# Altium project MU-RK3576J-MB.PrjPCB (part 7 of 13)

## Sheet V-by-One.SchDoc
size 420 x 297 mm; SheetNumber: 21; SheetTotal: 32; DocumentTypeShort: Э3; DocumentInvertoryNumber: ㅤ
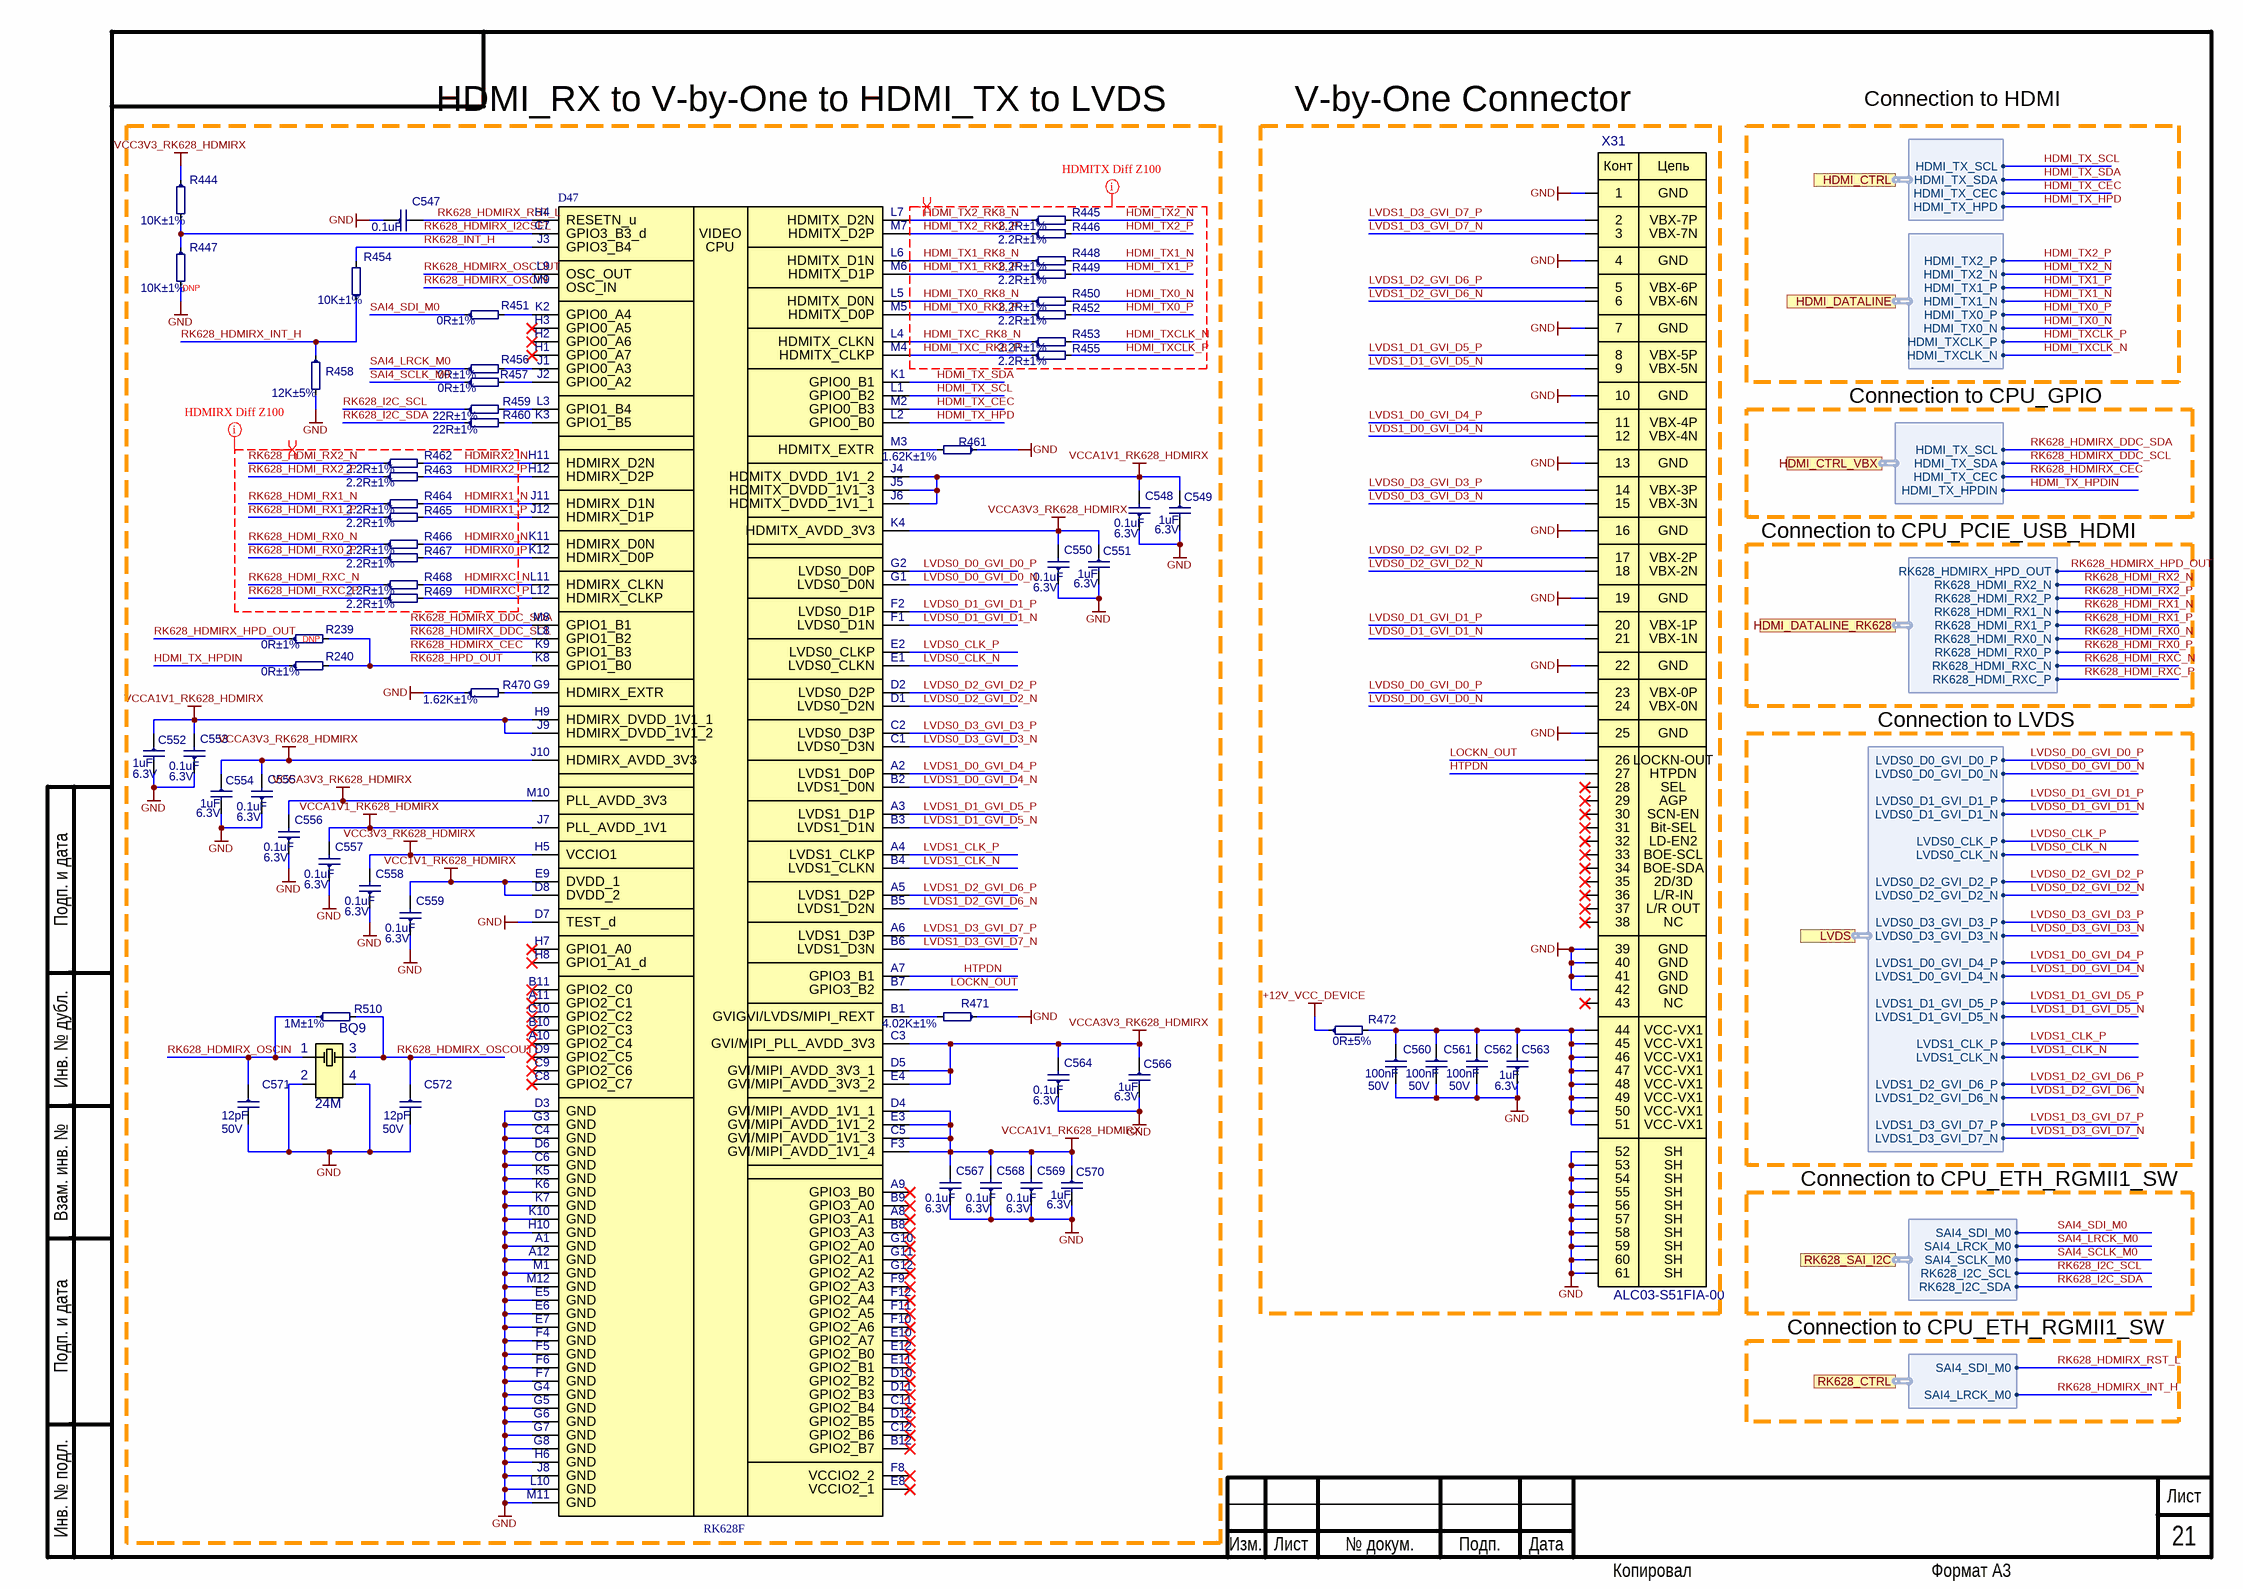
[diagram p17: V-by-One.SchDoc]

### Parts
BQ9  24M  [NX3225GA]
C547  0.1uF  [C0201]
C548  0.1uF  Voltage: 6.3V  [C0201]
C549  1uF  Voltage: 6.3V  [C0201]
C550  0.1uF  Voltage: 6.3V  [C0201]
C551  1uF  Voltage: 6.3V  [C0201]
C552  1uF  Voltage: 6.3V  [C0201]
C553  0.1uF  Voltage: 6.3V  [C0201]
C554  1uF  Voltage: 6.3V  [C0201]
C555  0.1uF  Voltage: 6.3V  [C0201]
C556  0.1uF  Voltage: 6.3V  [C0201]
C557  0.1uF  Voltage: 6.3V  [C0201]
C558  0.1uF  Voltage: 6.3V  [C0201]
C559  0.1uF  Voltage: 6.3V  [C0201]
C560  100nF  Voltage: 50V  [C0402]
C561  100nF  Voltage: 50V  [C0402]
C562  100nF  Voltage: 50V  [C0402]
C563  1uF  Voltage: 6.3V  [C0201]
C564  0.1uF  Voltage: 6.3V  [C0201]
C566  1uF  Voltage: 6.3V  [C0201]
C567  0.1uF  Voltage: 6.3V  [C0201]
C568  0.1uF  Voltage: 6.3V  [C0201]
C569  0.1uF  Voltage: 6.3V  [C0201]
C570  1uF  Voltage: 6.3V  [C0201]
C571  12pF  Voltage: 50V  [C0402]
C572  12pF  Voltage: 50V  [C0402]
D47  RK628F  [RK628F]
R239  0R±1%  [R0402]
R240  0R±1%  [R0402]
R444  10K±1%  [R0402]
R445  2.2R±1%  [R0402]
R446  2.2R±1%  [R0402]
R447  10K±1%  [R0402]
R448  2.2R±1%  [R0402]
R449  2.2R±1%  [R0402]
R450  2.2R±1%  [R0402]
R451  0R±1%  [R0402]
R452  2.2R±1%  [R0402]
R453  2.2R±1%  [R0402]
R454  10K±1%  [R0402]
R455  2.2R±1%  [R0402]
R456  0R±1%  [R0402]
R457  0R±1%  [R0402]
R458  12K±5%  [R0402]
R459  22R±1%  [R0402]
R460  22R±1%  [R0402]
R461  1.62K±1%  [R0402]
R462  2.2R±1%  [R0402]
R463  2.2R±1%  [R0402]
R464  2.2R±1%  [R0402]
R465  2.2R±1%  [R0402]
R466  2.2R±1%  [R0402]
R467  2.2R±1%  [R0402]
R468  2.2R±1%  [R0402]
R469  2.2R±1%  [R0402]
R470  1.62K±1%  [R0402]
R471  4.02K±1%  [R0402]
R472  0R±5%  [R2010]
R510  1M±1%  [R0402]
X31  ALC03-S51FIA-00  [ALC03-S51FIA-00]

### Ports
HDMI_CTRL (harness HDMI_CTRL), HDMI_CTRL_VBX (harness HDMI_CTRL_VBX), HDMI_DATALINE (harness HDMI_DATALINE), HDMI_DATALINE_RK628 (harness HDMI_DATALINE_RK628), LVDS (harness LVDS), RK628_CTRL (harness RK628_CTRL), RK628_SAI_I2C (harness RK628_SAI_I2C)

### Harnesses
HDMI_CTRL: HDMI_TX_SDA, HDMI_TX_CEC, HDMI_TX_HPD, HDMI_TX_SCL
HDMI_DATALINE: HDMI_TX2_N, HDMI_TX1_P, HDMI_TX1_N, HDMI_TX2_P, HDMI_TX0_P, HDMI_TX0_N, HDMI_TXCLK_P, HDMI_TXCLK_N
HDMI_CTRL_VBX: HDMI_TX_SDA, HDMI_TX_CEC, HDMI_TX_SCL, HDMI_TX_HPDIN
LVDS: LVDS0_D0_GVI_D0_N, LVDS0_D1_GVI_D1_P, LVDS0_D1_GVI_D1_N, LVDS0_D0_GVI_D0_P, LVDS0_CLK_P, LVDS0_CLK_N, LVDS0_D2_GVI_D2_P, LVDS0_D2_GVI_D2_N, LVDS0_D3_GVI_D3_P, LVDS0_D3_GVI_D3_N, LVDS1_D0_GVI_D4_P, LVDS1_D0_GVI_D4_N, LVDS1_D1_GVI_D5_P, LVDS1_D1_GVI_D5_N, LVDS1_CLK_P, LVDS1_CLK_N, LVDS1_D2_GVI_D6_P, LVDS1_D2_GVI_D6_N, LVDS1_D3_GVI_D7_P, LVDS1_D3_GVI_D7_N
HDMI_DATALINE_RK628: RK628_HDMI_RX2_P, RK628_HDMI_RX1_N, RK628_HDMI_RX1_P, RK628_HDMI_RX2_N, RK628_HDMI_RX0_N, RK628_HDMI_RX0_P, RK628_HDMI_RXC_N, RK628_HDMI_RXC_P, RK628_HDMIRX_HPD_OUT
RK628_SAI_I2C: SAI4_LRCK_M0, SAI4_SCLK_M0, SAI4_SDI_M0, RK628_I2C_SCL, RK628_I2C_SDA
RK628_CTRL: SAI4_LRCK_M0, SAI4_SDI_M0

### Nets
+12V_VCC_DEVICE: R472.1
GND: BQ9.2 BQ9.4 C547.1 C548.1 C549.2 C550.1 C551.2 C552.2 C553.1 C554.2 C555.1 C556.1 C557.1 C558.1 C559.1 C560.2 C561.2 C562.2 C563.1 C564.1 C566.2 C567.1 C568.1 C569.1 C570.2 C571.2 C572.2 D47.A1(GND) D47.A12(GND) D47.C4(GND) D47.C6(GND) D47.D3(GND) D47.D6(GND) D47.D7(TEST_d) D47.E5(GND) D47.E6(GND) D47.E7(GND) D47.F4(GND) D47.F5(GND) D47.F6(GND) D47.F7(GND) D47.G3(GND) D47.G4(GND) D47.G5(GND) D47.G6(GND) D47.G7(GND) D47.G8(GND) D47.H6(GND) D47.H10(GND) D47.J8(GND) D47.K5(GND) D47.K6(GND) D47.K7(GND) D47.K10(GND) D47.L10(GND) D47.M1(GND) D47.M11(GND) D47.M12(GND) R447.2 R458.2 R461.1 R470.1 R471.1 X31.1 X31.4 X31.7 X31.10 X31.13 X31.16 X31.19 X31.22 X31.25 X31.39 X31.40 X31.41 X31.42 X31.52 X31.53 X31.54 X31.55 X31.56 X31.57 X31.58 X31.59 X31.60 X31.61
VCC1V1_RK628_HDMIRX: C559.2 D47.D8(DVDD_2) D47.E9(DVDD_1)
VCC3V3_RK628_HDMIRX: C558.2 D47.H5(VCCIO1) R444.1
VCCA1V1_RK628_HDMIRX: C548.2 C549.1 C552.1 C553.2 C557.2 C567.2 C568.2 C569.2 C570.1 D47.C5(GVI/MIPI_AVDD_1V1_3) D47.D4(GVI/MIPI_AVDD_1V1_1) D47.E3(GVI/MIPI_AVDD_1V1_2) D47.F3(GVI/MIPI_AVDD_1V1_4) D47.H9(HDMIRX_DVDD_1V1_1) D47.J4(HDMITX_DVDD_1V1_2) D47.J5(HDMITX_DVDD_1V1_3) D47.J6(HDMITX_DVDD_1V1_1) D47.J7(PLL_AVDD_1V1) D47.J9(HDMIRX_DVDD_1V1_2)
VCCA3V3_RK628_HDMIRX: C550.2 C551.1 C554.1 C555.2 C556.2 C564.2 C566.1 D47.C3(GVI/MIPI_PLL_AVDD_3V3) D47.D5(GVI/MIPI_AVDD_3V3_1) D47.E4(GVI/MIPI_AVDD_3V3_2) D47.J10(HDMIRX_AVDD_3V3) D47.K4(HDMITX_AVDD_3V3) D47.M10(PLL_AVDD_3V3)
HDMI_TX0_N: R450.2 ; port HDMI_DATALINE.HDMI_TX0_N
HDMI_TX0_P: R452.2 ; port HDMI_DATALINE.HDMI_TX0_P
HDMI_TX0_RK8_N: D47.L5(HDMITX_D0N) R450.1
HDMI_TX0_RK8_P: D47.M5(HDMITX_D0P) R452.1
HDMI_TX1_N: R448.2 ; port HDMI_DATALINE.HDMI_TX1_N
HDMI_TX1_P: R449.2 ; port HDMI_DATALINE.HDMI_TX1_P
HDMI_TX1_RK8_N: D47.L6(HDMITX_D1N) R448.1
HDMI_TX1_RK8_P: D47.M6(HDMITX_D1P) R449.1
HDMI_TX2_N: R445.2 ; port HDMI_DATALINE.HDMI_TX2_N
HDMI_TX2_P: R446.2 ; port HDMI_DATALINE.HDMI_TX2_P
HDMI_TX2_RK8_N: D47.L7(HDMITX_D2N) R445.1
HDMI_TX2_RK8_P: D47.M7(HDMITX_D2P) R446.1
HDMI_TX_CEC: D47.M2(GPIO0_B3) ; port HDMI_CTRL.HDMI_TX_CEC
HDMI_TX_HPD: D47.L2(GPIO0_B0) ; port HDMI_CTRL.HDMI_TX_HPD
HDMI_TX_HPDIN: R240.1 ; port HDMI_CTRL_VBX.HDMI_TX_HPDIN  [project net HDMI_CTRL_VBX.HDMI_TX_HPDIN]
HDMI_TX_SCL: D47.L1(GPIO0_B2) ; port HDMI_CTRL.HDMI_TX_SCL
HDMI_TX_SDA: D47.K1(GPIO0_B1) ; port HDMI_CTRL.HDMI_TX_SDA
HDMI_TXC_RK8_N: D47.L4(HDMITX_CLKN) R453.1
HDMI_TXC_RK8_P: D47.M4(HDMITX_CLKP) R455.1
HDMI_TXCLK_N: R453.2 ; port HDMI_DATALINE.HDMI_TXCLK_N
HDMI_TXCLK_P: R455.2 ; port HDMI_DATALINE.HDMI_TXCLK_P
HDMIRX0_N: D47.K11(HDMIRX_D0N) R466.2
HDMIRX0_P: D47.K12(HDMIRX_D0P) R467.2
HDMIRX1_N: D47.J11(HDMIRX_D1N) R464.2
HDMIRX1_P: D47.J12(HDMIRX_D1P) R465.2
HDMIRX2_N: D47.H11(HDMIRX_D2N) R462.2
HDMIRX2_P: D47.H12(HDMIRX_D2P) R463.2
HDMIRXC_N: D47.L11(HDMIRX_CLKN) R468.2
HDMIRXC_P: D47.L12(HDMIRX_CLKP) R469.2
HTPDN: D47.A7(GPIO3_B1) X31.27
LOCKN_OUT: D47.B7(GPIO3_B2) X31.26
LVDS0_CLK_N: D47.E1(LVDS0_CLKN) ; port LVDS.LVDS0_CLK_N
LVDS0_CLK_P: D47.E2(LVDS0_CLKP) ; port LVDS.LVDS0_CLK_P
LVDS0_D0_GVI_D0_N: D47.G1(LVDS0_D0N) X31.24 ; port LVDS.LVDS0_D0_GVI_D0_N
LVDS0_D0_GVI_D0_P: D47.G2(LVDS0_D0P) X31.23 ; port LVDS.LVDS0_D0_GVI_D0_P
LVDS0_D1_GVI_D1_N: D47.F1(LVDS0_D1N) X31.21 ; port LVDS.LVDS0_D1_GVI_D1_N
LVDS0_D1_GVI_D1_P: D47.F2(LVDS0_D1P) X31.20 ; port LVDS.LVDS0_D1_GVI_D1_P
LVDS0_D2_GVI_D2_N: D47.D1(LVDS0_D2N) X31.18 ; port LVDS.LVDS0_D2_GVI_D2_N
LVDS0_D2_GVI_D2_P: D47.D2(LVDS0_D2P) X31.17 ; port LVDS.LVDS0_D2_GVI_D2_P
LVDS0_D3_GVI_D3_N: D47.C1(LVDS0_D3N) X31.15 ; port LVDS.LVDS0_D3_GVI_D3_N
LVDS0_D3_GVI_D3_P: D47.C2(LVDS0_D3P) X31.14 ; port LVDS.LVDS0_D3_GVI_D3_P
LVDS1_CLK_N: D47.B4(LVDS1_CLKN) ; port LVDS.LVDS1_CLK_N
LVDS1_CLK_P: D47.A4(LVDS1_CLKP) ; port LVDS.LVDS1_CLK_P
LVDS1_D0_GVI_D4_N: D47.B2(LVDS1_D0N) X31.12 ; port LVDS.LVDS1_D0_GVI_D4_N
LVDS1_D0_GVI_D4_P: D47.A2(LVDS1_D0P) X31.11 ; port LVDS.LVDS1_D0_GVI_D4_P
LVDS1_D1_GVI_D5_N: D47.B3(LVDS1_D1N) X31.9 ; port LVDS.LVDS1_D1_GVI_D5_N
LVDS1_D1_GVI_D5_P: D47.A3(LVDS1_D1P) X31.8 ; port LVDS.LVDS1_D1_GVI_D5_P
LVDS1_D2_GVI_D6_N: D47.B5(LVDS1_D2N) X31.6 ; port LVDS.LVDS1_D2_GVI_D6_N
LVDS1_D2_GVI_D6_P: D47.A5(LVDS1_D2P) X31.5 ; port LVDS.LVDS1_D2_GVI_D6_P
LVDS1_D3_GVI_D7_N: D47.B6(LVDS1_D3N) X31.3 ; port LVDS.LVDS1_D3_GVI_D7_N
LVDS1_D3_GVI_D7_P: D47.A6(LVDS1_D3P) X31.2 ; port LVDS.LVDS1_D3_GVI_D7_P
RK628_HDMI_RX0_N: R466.1 ; port HDMI_DATALINE_RK628.RK628_HDMI_RX0_N
RK628_HDMI_RX0_P: R467.1 ; port HDMI_DATALINE_RK628.RK628_HDMI_RX0_P
RK628_HDMI_RX1_N: R464.1 ; port HDMI_DATALINE_RK628.RK628_HDMI_RX1_N
RK628_HDMI_RX1_P: R465.1 ; port HDMI_DATALINE_RK628.RK628_HDMI_RX1_P
RK628_HDMI_RX2_N: R462.1 ; port HDMI_DATALINE_RK628.RK628_HDMI_RX2_N
RK628_HDMI_RX2_P: R463.1 ; port HDMI_DATALINE_RK628.RK628_HDMI_RX2_P
RK628_HDMI_RXC_N: R468.1 ; port HDMI_DATALINE_RK628.RK628_HDMI_RXC_N
RK628_HDMI_RXC_P: R469.1 ; port HDMI_DATALINE_RK628.RK628_HDMI_RXC_P
RK628_HDMIRX_CEC: D47.K9(GPIO1_B3) ; port HDMI_CTRL_VBX.HDMI_TX_CEC  [project net HDMI_CTRL_VBX.HDMI_TX_CEC]
RK628_HDMIRX_DDC_SCL: D47.L8(GPIO1_B2) ; port HDMI_CTRL_VBX.HDMI_TX_SDA  [project net HDMI_CTRL_VBX.HDMI_TX_SDA]
RK628_HDMIRX_DDC_SDA: D47.M8(GPIO1_B1) ; port HDMI_CTRL_VBX.HDMI_TX_SCL  [project net HDMI_CTRL_VBX.HDMI_TX_SCL]
RK628_HDMIRX_HPD_OUT: R239.1 ; port HDMI_DATALINE_RK628.RK628_HDMIRX_HPD_OUT
RK628_HDMIRX_I2CSEL: D47.C7(GPIO3_B3_d) R444.2 R447.1
RK628_HDMIRX_INT_H: R454.1 R458.1 ; port RK628_CTRL.SAI4_LRCK_M0  [project net RK628_CTRL.SAI4_LRCK_M0]
RK628_HDMIRX_OSCIN: BQ9.1 C571.1 D47.M9(OSC_IN) R510.1
RK628_HDMIRX_OSCOUT: BQ9.3 C572.1 D47.L9(OSC_OUT) R510.2
RK628_HDMIRX_RST_L: C547.2 D47.H4(RESETN_u) ; port RK628_CTRL.SAI4_SDI_M0  [project net RK628_CTRL.SAI4_SDI_M0]
RK628_HPD_OUT: D47.K8(GPIO1_B0) R239.2 R240.2
RK628_I2C_SCL: R459.1 ; port RK628_SAI_I2C.RK628_I2C_SCL
RK628_I2C_SDA: R460.1 ; port RK628_SAI_I2C.RK628_I2C_SDA
RK628_INT_H: D47.J3(GPIO3_B4) R454.2
SAI4_LRCK_M0: R456.1 ; port RK628_SAI_I2C.SAI4_LRCK_M0  [project net RK628_SAI_I2C.SAI4_LRCK_M0]
SAI4_SCLK_M0: R457.1 ; port RK628_SAI_I2C.SAI4_SCLK_M0  [project net RK628_SAI_I2C.SAI4_SCLK_M0]
SAI4_SDI_M0: R451.1 ; port RK628_SAI_I2C.SAI4_SDI_M0  [project net RK628_SAI_I2C.SAI4_SDI_M0]
NetC560_1: C560.1 C561.1 C562.1 C563.2 R472.2 X31.44 X31.45 X31.46 X31.47 X31.48 X31.49 X31.50 X31.51
NetD47_B1: D47.B1(GVIGVI/LVDS/MIPI_REXT) R471.2
NetD47_G9: D47.G9(HDMIRX_EXTR) R470.2
NetD47_J1: D47.J1(GPIO0_A3) R456.2
NetD47_J2: D47.J2(GPIO0_A2) R457.2
NetD47_K2: D47.K2(GPIO0_A4) R451.2
NetD47_K3: D47.K3(GPIO1_B5) R460.2
NetD47_L3: D47.L3(GPIO1_B4) R459.2
NetD47_M3: D47.M3(HDMITX_EXTR) R461.2

Not connected (* = marked no-connect by the designer): D47 A8(GPIO3_A1)* A9(GPIO3_B0)* A10(GPIO2_C4)* A11(GPIO2_C1)* B8(GPIO3_A3)* B9(GPIO3_A0)* B10(GPIO2_C3)* B11(GPIO2_C0)* B12(GPIO2_B7)* C8(GPIO2_C7)* C9(GPIO2_C6)* C10(GPIO2_C2)* C11(GPIO2_B4)* C12(GPIO2_B6)* D9(GPIO2_C5)* D10(GPIO2_B2)* D11(GPIO2_B3)* D12(GPIO2_B5)* E8(VCCIO2_1)* E10(GPIO2_A7)* E11(GPIO2_B1)* E12(GPIO2_B0)* F8(VCCIO2_2)* F9(GPIO2_A3)* F10(GPIO2_A6)* F11(GPIO2_A5)* F12(GPIO2_A4)* G10(GPIO2_A0)* G11(GPIO2_A1)* G12(GPIO2_A2)* H1(GPIO0_A7)* H2(GPIO0_A6)* H3(GPIO0_A5)* H7(GPIO1_A0)* H8(GPIO1_A1_d)*; X31 28* 29* 30* 31* 32* 33* 34* 35* 36* 37* 38* 43*

### Layout directives
net class HDMIRX: HDMIRX0_N, HDMIRX0_P, HDMIRX1_N, HDMIRX1_P, HDMIRX2_N, HDMIRX2_P, HDMIRXC_N, HDMIRXC_P, RK628_HDMI_RX0_N, RK628_HDMI_RX0_P, RK628_HDMI_RX1_N, RK628_HDMI_RX1_P, RK628_HDMI_RX2_N, RK628_HDMI_RX2_P, RK628_HDMI_RXC_N, RK628_HDMI_RXC_P
net class HDMITX: HDMI_TX0_N, HDMI_TX0_P, HDMI_TX0_RK8_N, HDMI_TX0_RK8_P, HDMI_TX1_N, HDMI_TX1_P, HDMI_TX1_RK8_N, HDMI_TX1_RK8_P, HDMI_TX2_N, HDMI_TX2_P, HDMI_TX2_RK8_N, HDMI_TX2_RK8_P, HDMI_TXC_RK8_N, HDMI_TXC_RK8_P, HDMI_TXCLK_N, HDMI_TXCLK_P
differential pair; differential pair class Diff_Z100: HDMI_TX0_N, HDMI_TX0_P, HDMI_TX0_RK8_N, HDMI_TX0_RK8_P, HDMI_TX1_N, HDMI_TX1_P, HDMI_TX1_RK8_N, HDMI_TX1_RK8_P, HDMI_TX2_N, HDMI_TX2_P, HDMI_TX2_RK8_N, HDMI_TX2_RK8_P, HDMI_TXC_RK8_N, HDMI_TXC_RK8_P, HDMI_TXCLK_N, HDMI_TXCLK_P, HDMIRX0_N, HDMIRX0_P, HDMIRX1_N, HDMIRX1_P, HDMIRX2_N, HDMIRX2_P, HDMIRXC_N, HDMIRXC_P, RK628_HDMI_RX0_N, RK628_HDMI_RX0_P, RK628_HDMI_RX1_N, RK628_HDMI_RX1_P, RK628_HDMI_RX2_N, RK628_HDMI_RX2_P, RK628_HDMI_RXC_N, RK628_HDMI_RXC_P

### Notes on the sheet
- HDMI_RX to V-by-One to HDMI_TX to LVDS
- V-by-One Connector
- Connection to HDMI
- (near R447) DNP
- Connection to CPU_GPIO
- Connection to CPU_PCIE_USB_HDMI
- (near R239) DNP
- Connection to LVDS
- Connection to CPU_ETH_RGMII1_SW
- Подп. и дата
- Инв. № дубл.
- Взам. инв. №
- Инв. № подл.
- Изм.
- Лист
- № докум.
- Подп.
- Дата
- Копировал
- Формат А3
- (in symbol ALC03-S51FIA-00) Конт; Цепь; GND; VBX-7P; VBX-7N; VBX-6P; VBX-6N; VBX-5P; VBX-5N; VBX-4P; VBX-4N; VBX-3P; VBX-3N; VBX-2P; VBX-2N; VBX-1P; VBX-1N; VBX-0P; VBX-0N; LOCKN-OUT; HTPDN; SEL; AGP; SCN-EN; Bit-SEL; LD-EN2; BOE-SCL; BOE-SDA; 2D/3D; L/R-IN; L/R OUT; NC; VCC-VX1; SH
- (in symbol RK628F) VIDEO; CPU

### Library data of the parts
BQ9 = NX3225GA-24M-18pF-10ppm: Part Number: 3225-24-18-10-10/4B; Manufacturer: Liming; Place: S; Tolerance: 10ppm; Check: False; Value: 24M; NameFromManufacturer: 3225-24-18-10-10/4B; ComponentLink1Description: DATASHEET; ComponentLink1URL: https://www.raltron.com/wp-content/uploads/2019/07/RH100_SERIES-July-2019.pdf; Last changed: 27.10.2022
C547 = 0201-X5R-6.3V-0.1uF±10%: Manufacturer: Yageo; NameFromManufacturer: CC0201KRX5R5BB104; Dielectric: X5R; Voltage: 6.3V; Place: *); Tolerance: 10%; Check: False; Case: C0201; Part Number: 0201-X5R-6.3V-0.1uF±10%; Value: 0.1uF; Temperature: -55°C~85°C; ComponentLink2Description: Link to datasheet; ComponentLink1Description: DATASHEET; ComponentLink2URL: https://www.terraelectronica.ru/product/1020032; ComponentLink1URL: Datasheets/capacitors/UPY-GPHC_X5R_4V-to-50V_27.pdf; Last changed: 27.10.2022
C548 C550 C553 C555-C559 C564 C567-C569 = 0201-X5R-6.3V-0.1uF±10%: Manufacturer: Yageo; NameFromManufacturer: CC0201KRX5R5BB104; Dielectric: X5R; Place: *); Tolerance: 10%; Check: False; Case: C0201; Part Number: 0201-X5R-6.3V-0.1uF±10%; Value: 0.1uF; Temperature: -55°C~85°C; ComponentLink2Description: Link to datasheet; ComponentLink1Description: DATASHEET; ComponentLink2URL: https://www.terraelectronica.ru/product/1020032; ComponentLink1URL: Datasheets/capacitors/UPY-GPHC_X5R_4V-to-50V_27.pdf; Last changed: 27.10.2022
C549 C551 C552 C554 C563 C566 C570 = 0201-X5R-6.3V-1uF±20%: Manufacturer: Murata Electronics; NameFromManufacturer: GRM033R60J105MEA2D; Dielectric: X5R; Place: *); Tolerance: 20%; Check: False; Case: C0201; Part Number: 0201-X5R-6.3V-1uF±20%; Value: 1uF; Temperature: -55°C~85°C; ComponentLink2Description: Link to datasheet; ComponentLink1Description: DATASHEET; ComponentLink2URL: https://www.terraelectronica.ru/product/1209278; ComponentLink1URL: Datasheets/capacitors/GRM033R60J105MEA2-61A.pdf; Last changed: 27.10.2022
C560-C562 = 0402-X7R-50V-0.1uF±10%: Ceramic Capacitor 0402 100nF ±10% 50V X7R; Manufacturer: Yageo; NameFromManufacturer: CC0402KRX7R9BB104; Place: *); Check: False; Dielectric: X7R; Case: C0402; Part Number: 0402-X7R-50V-0.1uF±10%; Value: 100nF; Tolerance: 10%; Temperature: -55°C~125°C; ComponentLink2Description: Link to datasheet; ComponentLink1Description: DATASHEET; ComponentLink2URL: https://www.lcsc.com/product-detail/Multilayer-Ceramic-Capacitors-MLCC-SMD-SMT_YAGEO-CC0402KRX7R9BB104_C131394.html; Last changed: 09.04.2025
C571 C572 = 0402-NP0-50V-12pF±5%: Manufacturer: Murata Electronics; NameFromManufacturer: GRM1555C1H120JA01D; Dielectric: NP0; Place: *); Tolerance: 5%; Check: False; Case: C0402; Part Number: 0402-NP0-50V-12pF±5%; Value: 12pF; Temperature: -55°C~125°C; ComponentLink2Description: Link to datasheet; ComponentLink1Description: DATASHEET; ComponentLink2URL: https://www.terraelectronica.ru/pdf/show?pdf_file=http%253A%252F%252Fwww.farnell.com%252Fdatasheets%252F2048662.pdf; ComponentLink1URL: Datasheets/capacitors/GRM1555C1H120JA01-01A.pdf; Last changed: 27.10.2022
D47 = RK628F: Bridge BGA-144L(8x8) Video Processing RoHS; Manufacturer: Rockchip; Check: False; Part Number: RK628F; Value: RK628F; NameFromManufacturer: RK628F
R239 R240 R451 R456 R457 = 0402-0.0625W-0R-100ppm±1%: Chip Resistor 0402 0Ω ±1% 50V ±100ppm/℃ Thick Film; NameFromManufacturer: RC0402FR-070RL; Manufacturer: Yageo; Place: *); Value: 0R; Check: False; Case: R0402; Part Number: 0402-0.0625W-0R-100ppm±1%; Tolerance: 1%; Temperature: -55°C~155°C; ComponentLink1Description: DATASHEET; ComponentLink1URL: https://www.chipdip.ru/product0/8000617426?ysclid=l7og5x0plo427794326; Datasheet: Datasheets/resistors/DOC012445956.pdf; Last changed: 27.10.2022
R444 R447 R454 = 0402-0.0625W-10K-100ppm±1%: Chip Resistor 0402 10kΩ ±1% 50V ±100ppm/℃ Thick Film; NameFromManufacturer: RC0402FR-0710KL; Manufacturer: Yageo; Place: *); Value: 10K; Check: False; Case: R0402; Part Number: 0402-0.0625W-10K-100ppm±1%; Tolerance: 1%; Temperature: -55°C~155°C; ComponentLink1Description: DATASHEET; ComponentLink1URL: https://ru.mouser.com/ProductDetail/YAGEO/RC0402FR-0710KL?qs=%2Fha2pyFaduhjtLcYvKXQ8IogF7YwN7YtH%252BOO8ZtEEMnoa4yoWYcwpw%3D%3D; Datasheet: Datasheets/resistors/PYu-RC_Group_51_RoHS_L_11.pdf; Last changed: 27.10.2022
R445 R446 R448-R450 R452 R453 R455 R462-R469 = 0402-0.0625W-1.2R-100ppm±1%: Part Number: 0402-0.0625W-2.2R-100ppm±1%; NameFromManufacturer: AC0402FR-072R2L; Manufacturer: Yageo; Place: *); Value: 2.2R; Tolerance: 1%; Check: False; Case: R0402; Temperature: -55°C~155°C; ComponentLink1Description: DATASHEET; ComponentLink1URL: https://www.chipdip.ru/product0/9000189669; Datasheet: Datasheets/resistors/DOC011312614.pdf; Last changed: 27.10.2022
R458 = 0402-0.0625W-12K-100ppm±5%: NameFromManufacturer: WR04X123JTL; Manufacturer: Walsin Technology Corporation; Place: *); Value: 12K; Tolerance: 5%; Check: False; Case: R0402; Part Number: 0402-0.0625W-12K-100ppm±5%; Temperature: -55°C~155°C; ComponentLink1Description: DATASHEET; ComponentLink1URL: https://eu.mouser.com/ProductDetail/Walsin/WR04X123-JTL?qs=1w%252B2sDiFrrEqkjp89ZDzsQ%3D%3D; Datasheet: Datasheets\resistors\WR04X103JTL-datasheet-pdf-ru.findic.com.pdf#Datasheets\resistors\WR04X103JTL-datasheet-pdf-ru.findic.com.pdf#; Last changed: 07.11.2022
R459 R460 = 0402-0.0625W-22R-100ppm±1%: Chip Resistor 0402 22Ω ±1% 50V ±100ppm/℃ Thick Film; NameFromManufacturer: RC0402FR-0722RL; Manufacturer: Yageo; Place: *); Value: 22R; Check: False; Case: R0402; Part Number: 0402-0.0625W-22R-100ppm±1%; Tolerance: 1%; Temperature: -55°C~155°C; ComponentLink1Description: DATASHEET; ComponentLink1URL: https://www.yageo.com/upload/media/product/productsearch/datasheet/rchip/PYu-RC_Group_51_RoHS_L_11.pdf; Datasheet: Datasheets/resistors/PYu-RC_Group_51_RoHS_L_11.pdf; Last changed: 27.10.2022
R461 R470 = 0402-0.0625W-1.62K-100ppm±1%: NameFromManufacturer: RC0402FR-071K62L; Manufacturer: Yageo; Place: *); Value: 1.62K; Tolerance: 1%; Check: False; Case: R0402; Part Number: 0402-0.0625W-1.62K-100ppm±1%; Temperature: -55°C~155°C; ComponentLink1Description: DATASHEET; ComponentLink1URL: https://www.digikey.com/en/products/detail/yageo/RC0402FR-071K62L/5280902; Datasheet: Datasheets/resistors/PYu-RC_Group_51_RoHS_L_11.pdf; Last changed: 27.10.2022
R471 = 0402-0.0625W-1.62K-100ppm±1%: Part Number: 0402-0.0625W-4.02K-100ppm±1%; NameFromManufacturer: RC0402FR-074K02L; Manufacturer: Yageo; Place: *); Value: 4.02K; Tolerance: 1%; Check: False; Case: R0402; Temperature: -55°C~155°C; ComponentLink1Description: DATASHEET; ComponentLink1URL: https://www.digikey.com/en/products/detail/yageo/RC0402FR-071K62L/5280902; Datasheet: Datasheets/resistors/PYu-RC_Group_51_RoHS_L_11.pdf; Last changed: 27.10.2022
R472 = 2010-0.75W-0R-200ppm±5%: Chip Resistor 2010 0Ω ±5% 200V ±200ppm/℃ Thick Film; NameFromManufacturer: RC2010JK-070RL; Manufacturer: Yageo; Place: *); Value: 0R; Check: False; Case: R2010; Part Number: 2010-0.75W-0R-200ppm±5%; Tolerance: 5%; Temperature: -55°C~155°C; ComponentLink1Description: DATASHEET; ComponentLink1URL: https://www.lcsc.com/product-detail/Chip-Resistor-Surface-Mount_YAGEO-RC2010JK-070RL_C152156.html; Last changed: 16.07.2024
R510 = 0402-0.0625W-1M-100ppm±1%: Chip Resistor 0402 1MΩ ±1% 50V ±100ppm/℃ Thick Film; NameFromManufacturer: RC0402FR-071ML; Manufacturer: Yageo; Place: *); Value: 1M; Check: False; Case: R0402; Part Number: 0402-0.0625W-1M-100ppm±1%; Tolerance: 1%; Temperature: -55°C~155°C; ComponentLink1Description: DATASHEET; ComponentLink1URL: https://www.yageo.com/upload/media/product/productsearch/datasheet/rchip/PYu-RC_Group_51_RoHS_L_11.pdf; Datasheet: Datasheets/resistors/PYu-RC_Group_51_RoHS_L_11.pdf; Last changed: 27.10.2022
X31 = ALC03-S51FIA-00: Non-Latching 51P 0.5mm 500mA 50V Bottom Contact Surface Mount, Right Angle SMD,P=0.5mm,Surface Mount,Right Angle FFC, FPC (Flat Flexible) Connector Assemblies RoHS; Manufacturer: JUSHUO; Check: False; Part Number: ALC03-S51FIA-00; Value: ALC03-S51FIA-00; NameFromManufacturer: ALC03-S51FIA-00

## Sheet LVDS_eDP.SchDoc
size 420 x 297 mm; SheetNumber: 22; SheetTotal: 32; DocumentTypeShort: Э3; DocumentInvertoryNumber: ㅤ
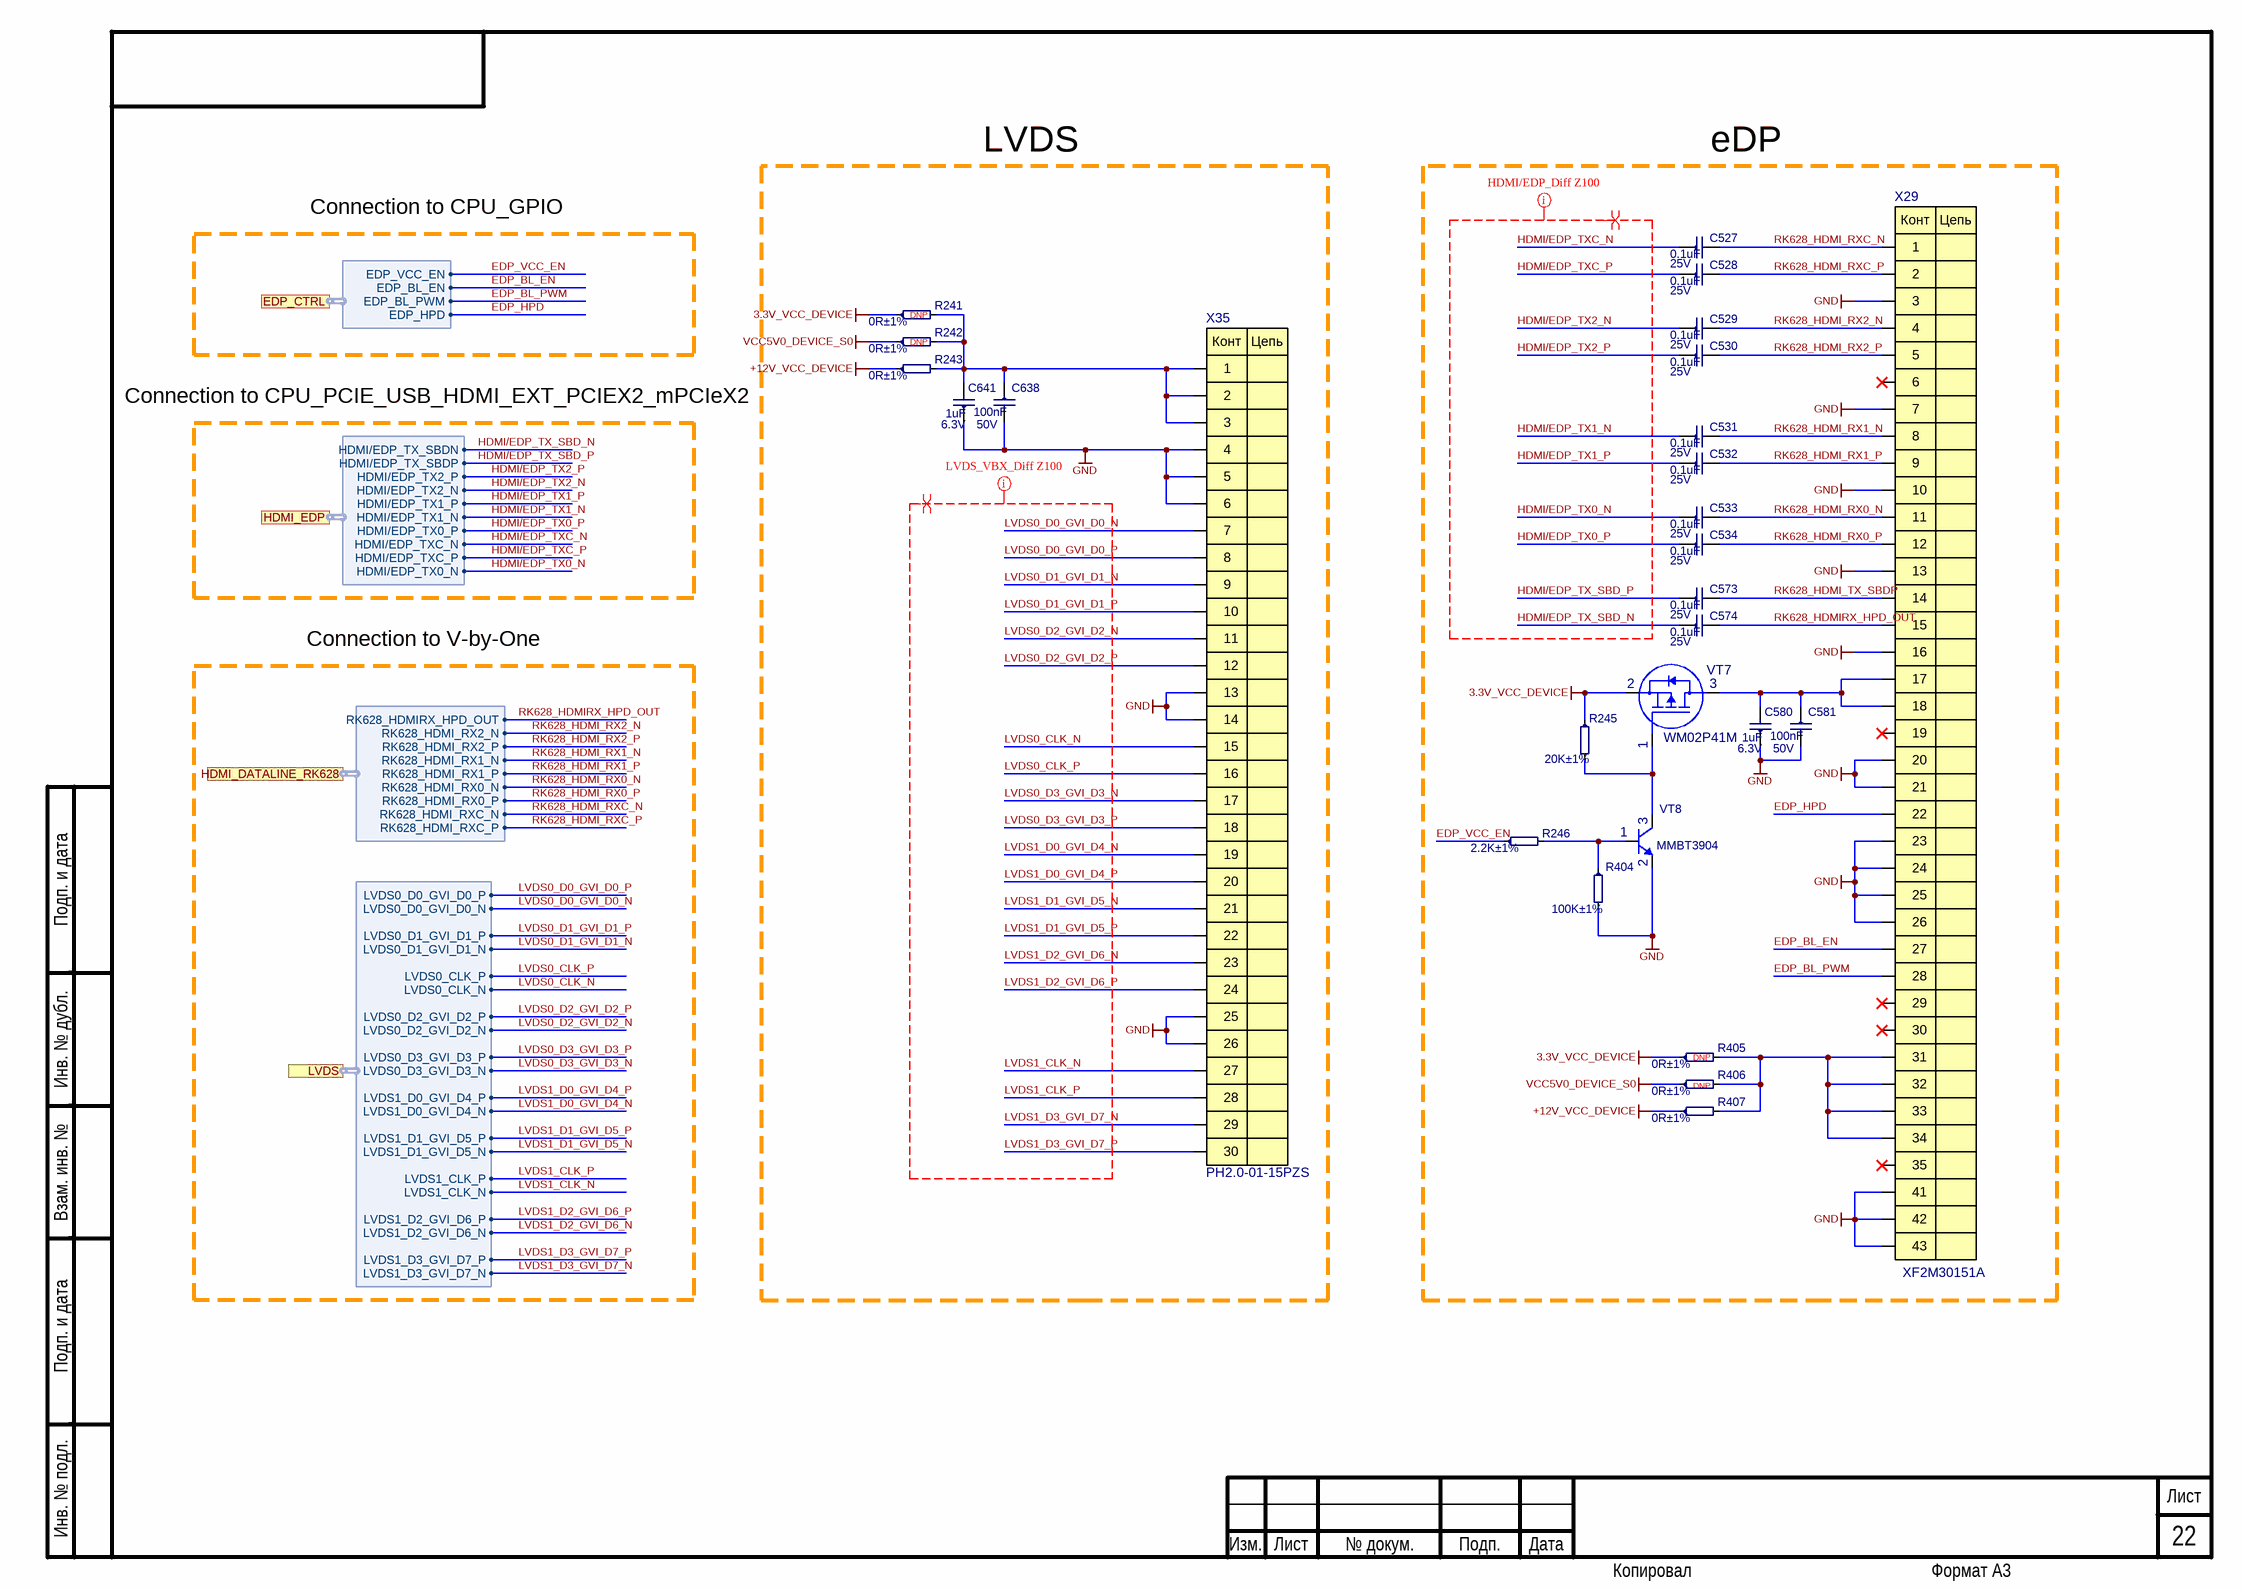
[diagram p18: LVDS_eDP.SchDoc]

### Parts
C527  0.1uF  Voltage: 25V  [C0201]
C528  0.1uF  Voltage: 25V  [C0201]
C529  0.1uF  Voltage: 25V  [C0201]
C530  0.1uF  Voltage: 25V  [C0201]
C531  0.1uF  Voltage: 25V  [C0201]
C532  0.1uF  Voltage: 25V  [C0201]
C533  0.1uF  Voltage: 25V  [C0201]
C534  0.1uF  Voltage: 25V  [C0201]
C573  0.1uF  Voltage: 25V  [C0201]
C574  0.1uF  Voltage: 25V  [C0201]
C580  1uF  Voltage: 6.3V  [C0201]
C581  100nF  Voltage: 50V  [C0402]
C638  100nF  Voltage: 50V  [C0402]
C641  1uF  Voltage: 6.3V  [C0201]
R241  0R±1%  [R0402]
R242  0R±1%  [R0402]
R243  0R±1%  [R0402]
R245  20K±1%  [R0402]
R246  2.2K±1%  [R0402]
R404  100K±1%  [R0402]
R405  0R±1%  [R0402]
R406  0R±1%  [R0402]
R407  0R±1%  [R0402]
VT7  WM02P41M  [SOT23]
VT8  MMBT3904  [SOT23]
X29  XF2M30151A  [XF2M30151A]
X35  PH2.0-01-15PZS  [PH2.0-01-15PZS]

### Ports
EDP_CTRL (harness EDP_CTRL), HDMI_DATALINE_RK628 (harness HDMI_DATALINE_RK628), HDMI_EDP (harness HDMI_EDP), LVDS (harness LVDS)

### Harnesses
LVDS: LVDS0_D0_GVI_D0_N, LVDS0_D1_GVI_D1_P, LVDS0_D1_GVI_D1_N, LVDS0_D0_GVI_D0_P, LVDS0_CLK_P, LVDS0_CLK_N, LVDS0_D2_GVI_D2_P, LVDS0_D2_GVI_D2_N, LVDS0_D3_GVI_D3_P, LVDS0_D3_GVI_D3_N, LVDS1_D0_GVI_D4_P, LVDS1_D0_GVI_D4_N, LVDS1_D1_GVI_D5_P, LVDS1_D1_GVI_D5_N, LVDS1_CLK_P, LVDS1_CLK_N, LVDS1_D2_GVI_D6_P, LVDS1_D2_GVI_D6_N, LVDS1_D3_GVI_D7_P, LVDS1_D3_GVI_D7_N
HDMI_EDP: HDMI/EDP_TX2_N, HDMI/EDP_TX1_P, HDMI/EDP_TX1_N, HDMI/EDP_TX2_P, HDMI/EDP_TX0_P, HDMI/EDP_TXC_N, HDMI/EDP_TXC_P, HDMI/EDP_TX0_N, HDMI/EDP_TX_SBDN, HDMI/EDP_TX_SBDP
HDMI_DATALINE_RK628: RK628_HDMI_RX2_P, RK628_HDMI_RX1_N, RK628_HDMI_RX1_P, RK628_HDMI_RX2_N, RK628_HDMI_RX0_N, RK628_HDMI_RX0_P, RK628_HDMI_RXC_N, RK628_HDMI_RXC_P, RK628_HDMIRX_HPD_OUT
EDP_CTRL: EDP_BL_EN, EDP_BL_PWM, EDP_VCC_EN, EDP_HPD

### Nets
3.3V_VCC_DEVICE: R241.1 R245.1 R405.1 VT7.2
+12V_VCC_DEVICE: R243.1 R407.1
GND: C580.1 C581.2 C638.2 C641.1 R404.2 VT8.2(E) X29.3 X29.7 X29.10 X29.13 X29.16 X29.20 X29.21 X29.23 X29.24 X29.25 X29.26 X29.41 X29.42 X29.43 X35.4 X35.5 X35.6 X35.13 X35.14 X35.25 X35.26
VCC5V0_DEVICE_S0: R242.1 R406.1
EDP_BL_EN: X29.27 ; port EDP_CTRL.EDP_BL_EN
EDP_BL_PWM: X29.28 ; port EDP_CTRL.EDP_BL_PWM
EDP_HPD: X29.22 ; port EDP_CTRL.EDP_HPD  [project net EDP_CTRL.EDP_HPD]
EDP_VCC_EN: R246.1 ; port EDP_CTRL.EDP_VCC_EN  [project net EDP_CTRL.EDP_VCC_EN]
HDMI/EDP_TX0_N: C533.1 ; port HDMI_EDP.HDMI/EDP_TX0_N
HDMI/EDP_TX0_P: C534.1 ; port HDMI_EDP.HDMI/EDP_TX0_P
HDMI/EDP_TX1_N: C531.1 ; port HDMI_EDP.HDMI/EDP_TX1_N
HDMI/EDP_TX1_P: C532.1 ; port HDMI_EDP.HDMI/EDP_TX1_P
HDMI/EDP_TX2_N: C529.1 ; port HDMI_EDP.HDMI/EDP_TX2_N
HDMI/EDP_TX2_P: C530.1 ; port HDMI_EDP.HDMI/EDP_TX2_P
HDMI/EDP_TX_SBD_N: C574.1 ; port HDMI_EDP.HDMI/EDP_TX_SBDN
HDMI/EDP_TX_SBD_P: C573.1 ; port HDMI_EDP.HDMI/EDP_TX_SBDP
HDMI/EDP_TXC_N: C527.1 ; port HDMI_EDP.HDMI/EDP_TXC_N
HDMI/EDP_TXC_P: C528.1 ; port HDMI_EDP.HDMI/EDP_TXC_P
LVDS0_CLK_N: X35.15 ; port LVDS.LVDS0_CLK_N
LVDS0_CLK_P: X35.16 ; port LVDS.LVDS0_CLK_P
LVDS0_D0_GVI_D0_N: X35.7 ; port LVDS.LVDS0_D0_GVI_D0_N
LVDS0_D0_GVI_D0_P: X35.8 ; port LVDS.LVDS0_D0_GVI_D0_P
LVDS0_D1_GVI_D1_N: X35.9 ; port LVDS.LVDS0_D1_GVI_D1_N
LVDS0_D1_GVI_D1_P: X35.10 ; port LVDS.LVDS0_D1_GVI_D1_P
LVDS0_D2_GVI_D2_N: X35.11 ; port LVDS.LVDS0_D2_GVI_D2_N
LVDS0_D2_GVI_D2_P: X35.12 ; port LVDS.LVDS0_D2_GVI_D2_P
LVDS0_D3_GVI_D3_N: X35.17 ; port LVDS.LVDS0_D3_GVI_D3_N
LVDS0_D3_GVI_D3_P: X35.18 ; port LVDS.LVDS0_D3_GVI_D3_P
LVDS1_CLK_N: X35.27 ; port LVDS.LVDS1_CLK_N
LVDS1_CLK_P: X35.28 ; port LVDS.LVDS1_CLK_P
LVDS1_D0_GVI_D4_N: X35.19 ; port LVDS.LVDS1_D0_GVI_D4_N
LVDS1_D0_GVI_D4_P: X35.20 ; port LVDS.LVDS1_D0_GVI_D4_P
LVDS1_D1_GVI_D5_N: X35.21 ; port LVDS.LVDS1_D1_GVI_D5_N
LVDS1_D1_GVI_D5_P: X35.22 ; port LVDS.LVDS1_D1_GVI_D5_P
LVDS1_D2_GVI_D6_N: X35.23 ; port LVDS.LVDS1_D2_GVI_D6_N
LVDS1_D2_GVI_D6_P: X35.24 ; port LVDS.LVDS1_D2_GVI_D6_P
LVDS1_D3_GVI_D7_N: X35.29 ; port LVDS.LVDS1_D3_GVI_D7_N
LVDS1_D3_GVI_D7_P: X35.30 ; port LVDS.LVDS1_D3_GVI_D7_P
RK628_HDMI_RX0_N: C533.2 X29.11 ; port HDMI_DATALINE_RK628.RK628_HDMI_RX0_N
RK628_HDMI_RX0_P: C534.2 X29.12 ; port HDMI_DATALINE_RK628.RK628_HDMI_RX0_P
RK628_HDMI_RX1_N: C531.2 X29.8 ; port HDMI_DATALINE_RK628.RK628_HDMI_RX1_N
RK628_HDMI_RX1_P: C532.2 X29.9 ; port HDMI_DATALINE_RK628.RK628_HDMI_RX1_P
RK628_HDMI_RX2_N: C529.2 X29.4 ; port HDMI_DATALINE_RK628.RK628_HDMI_RX2_N
RK628_HDMI_RX2_P: C530.2 X29.5 ; port HDMI_DATALINE_RK628.RK628_HDMI_RX2_P
RK628_HDMI_RXC_N: C527.2 X29.1 ; port HDMI_DATALINE_RK628.RK628_HDMI_RXC_N
RK628_HDMI_RXC_P: C528.2 X29.2 ; port HDMI_DATALINE_RK628.RK628_HDMI_RXC_P
RK628_HDMI_TX_SBDP: C573.2 X29.14
RK628_HDMIRX_HPD_OUT: C574.2 X29.15 ; port HDMI_DATALINE_RK628.RK628_HDMIRX_HPD_OUT
NetC580_2: C580.2 C581.1 VT7.3 X29.17 X29.18
NetC638_1: C638.1 C641.2 R241.2 R242.2 R243.2 X35.1 X35.2 X35.3
NetR245_2: R245.2 VT7.1 VT8.3(C)
NetR246_2: R246.2 R404.1 VT8.1(B)
NetR405_2: R405.2 R406.2 R407.2 X29.31 X29.32 X29.33 X29.34

Not connected (* = marked no-connect by the designer): X29 6* 19* 29* 30* 35*

### Layout directives
net class LVDS_VBX: LVDS0_CLK_N, LVDS0_CLK_P, LVDS0_D0_GVI_D0_N, LVDS0_D0_GVI_D0_P, LVDS0_D1_GVI_D1_N, LVDS0_D1_GVI_D1_P, LVDS0_D2_GVI_D2_N, LVDS0_D2_GVI_D2_P, LVDS0_D3_GVI_D3_N, LVDS0_D3_GVI_D3_P, LVDS1_CLK_N, LVDS1_CLK_P, LVDS1_D0_GVI_D4_N, LVDS1_D0_GVI_D4_P, LVDS1_D1_GVI_D5_N, LVDS1_D1_GVI_D5_P, LVDS1_D2_GVI_D6_N, LVDS1_D2_GVI_D6_P, LVDS1_D3_GVI_D7_N, LVDS1_D3_GVI_D7_P
differential pair; differential pair class Diff_Z100: HDMI/EDP_TX0_N, HDMI/EDP_TX0_P, HDMI/EDP_TX1_N, HDMI/EDP_TX1_P, HDMI/EDP_TX2_N, HDMI/EDP_TX2_P, HDMI/EDP_TX_SBD_N, HDMI/EDP_TX_SBD_P, HDMI/EDP_TXC_N, HDMI/EDP_TXC_P, LVDS0_CLK_N, LVDS0_CLK_P, LVDS0_D0_GVI_D0_N, LVDS0_D0_GVI_D0_P, LVDS0_D1_GVI_D1_N, LVDS0_D1_GVI_D1_P, LVDS0_D2_GVI_D2_N, LVDS0_D2_GVI_D2_P, LVDS0_D3_GVI_D3_N, LVDS0_D3_GVI_D3_P, LVDS1_CLK_N, LVDS1_CLK_P, LVDS1_D0_GVI_D4_N, LVDS1_D0_GVI_D4_P, LVDS1_D1_GVI_D5_N, LVDS1_D1_GVI_D5_P, LVDS1_D2_GVI_D6_N, LVDS1_D2_GVI_D6_P, LVDS1_D3_GVI_D7_N, LVDS1_D3_GVI_D7_P
net class HDMI/EDP: HDMI/EDP_TX0_N, HDMI/EDP_TX0_P, HDMI/EDP_TX1_N, HDMI/EDP_TX1_P, HDMI/EDP_TX2_N, HDMI/EDP_TX2_P, HDMI/EDP_TX_SBD_N, HDMI/EDP_TX_SBD_P, HDMI/EDP_TXC_N, HDMI/EDP_TXC_P

### Notes on the sheet
- LVDS
- eDP
- Connection to CPU_GPIO
- (near R241) DNP
- Connection to CPU_PCIE_USB_HDMI_EXT_PCIEX2_mPCIeX2
- (near R242) DNP
- Connection to V-by-One
- (near R405) DNP
- (near R406) DNP
- Подп. и дата
- Инв. № дубл.
- Взам. инв. №
- Инв. № подл.
- Изм.
- Лист
- № докум.
- Подп.
- Дата
- Копировал
- Формат А3
- (in symbol PH2.0-01-15PZS) Конт; Цепь
- (in symbol XF2M30151A) Конт; Цепь

### Library data of the parts
C527-C534 C573 C574 = 0201-X5R-25V-0.1uF±10%: Manufacturer: Yageo; NameFromManufacturer: CC0201KRX5R8BB104; Dielectric: X5R; Place: *); Tolerance: 10%; Check: False; Case: C0201; Part Number: 0201-X5R-25V-0.1uF±10%; Value: 0.1uF; Temperature: -55°C~85°C; ComponentLink2Description: Link to datasheet; ComponentLink1Description: DATASHEET; ComponentLink2URL: https://octopart.com/cc0201krx5r8bb104-yageo-88496683?r=sp; ComponentLink1URL: Datasheets/capacitors/UPY-GPHC_X5R_4V-to-50V_26.pdf; Last changed: 27.10.2022
C580 C641 = 0201-X5R-6.3V-1uF±20%: as C549 on sheet V-by-One; Case: C0201; Part Number: 0201-X5R-6.3V-1uF±20%; Value: 1uF; Temperature: -55°C~85°C; ComponentLink2Description: Link to datasheet; ComponentLink1Description: DATASHEET; ComponentLink2URL: https://www.terraelectronica.ru/product/1209278; ComponentLink1URL: Datasheets/capacitors/GRM033R60J105MEA2-61A.pdf; Last changed: 27.10.2022
C581 C638 = 0402-X7R-50V-0.1uF±10%: as C560-C562 on sheet V-by-One; Dielectric: X7R; Case: C0402; Part Number: 0402-X7R-50V-0.1uF±10%; Value: 100nF; Tolerance: 10%; Temperature: -55°C~125°C; ComponentLink2Description: Link to datasheet; ComponentLink1Description: DATASHEET; ComponentLink2URL: https://www.lcsc.com/product-detail/Multilayer-Ceramic-Capacitors-MLCC-SMD-SMT_YAGEO-CC0402KRX7R9BB104_C131394.html; Last changed: 09.04.2025
R241-R243 R405-R407 = 0402-0.0625W-0R-100ppm±1%: as R239 on sheet V-by-One; Case: R0402; Part Number: 0402-0.0625W-0R-100ppm±1%; Tolerance: 1%; Temperature: -55°C~155°C; ComponentLink1Description: DATASHEET; ComponentLink1URL: https://www.chipdip.ru/product0/8000617426?ysclid=l7og5x0plo427794326; Datasheet: Datasheets/resistors/DOC012445956.pdf; Last changed: 27.10.2022
R245 = 0402-0.0625W-20K-100ppm±1%: Chip Resistor 0402 20kΩ ±1% 50V ±100ppm/℃ Thick Film; NameFromManufacturer: RC0402FR-0720KL; Manufacturer: Yageo; Place: *); Value: 20K; Check: False; Case: R0402; Part Number: 0402-0.0625W-20K-100ppm±1%; Tolerance: 1%; Temperature: -55°C~155°C; ComponentLink1Description: DATASHEET; ComponentLink1URL: https://www.terraelectronica.ru/product/506449; Datasheet: Datasheets/resistors/PYu-RC_Group_51_RoHS_L_11.pdf; Last changed: 27.10.2022
R246 = 0402-0.0625W-2.2K-100ppm±1%: *; NameFromManufacturer: RC0402FR-072K2L; Manufacturer: Yageo; Place: *); Value: 2.2K; Tolerance: 1%; Check: False; Case: R0402; Part Number: 0402-0.0625W-2.2K-100ppm±1%; Temperature: -55°C~155°C; ComponentLink1Description: DATASHEET; ComponentLink1URL: https://www.compel.ru/infosheet/YAG/SR0402FR-072K2L; Datasheet: Datasheets/resistors/PYu-SR_D_F tol_RoHS_L_5.pdf; Last changed: 27.10.2022
R404 = 0402-0.0625W-100K-100ppm±1%: Chip Resistor 0402 100kΩ ±1% 50V ±100ppm/℃ Thick Film; NameFromManufacturer: RC0402FR-07100KL; Manufacturer: Yageo; Place: *); Value: 100K; Check: False; Case: R0402; Part Number: 0402-0.0625W-100K-100ppm±1%; Tolerance: 1%; Temperature: -55°C~155°C; ComponentLink1Description: DATASHEET; ComponentLink1URL: https://www.yageo.com/upload/media/product/productsearch/datasheet/rchip/PYu-RC_Group_51_RoHS_L_11.pdf; Datasheet: Datasheets/resistors/PYu-RC_Group_51_RoHS_L_11.pdf; Last changed: 27.10.2022
VT7 = WM02P41M: Small signal mosfet; Manufacturer: Wayon; Place: S; Voltage: -20V; Check: False; Part Number: WM02P41M; Value: WM02P41M; Temperature: -55°C~150°C; ComponentLink1Description: DATASHEET; NameFromManufacturer: WM02P41M; ComponentLink1URL: https://www.terraelectronica.ru/product/5031341; Datasheet: Datasheets/transistors/UM6K34NTCN.pdf; Last changeв: 27.10.2022
VT8 = MMBT3904: NPN transistor; Manufacturer: Diotec Semiconductor; Place: S; Voltage: 40V; Check: False; Part Number: MMBT3904; Value: MMBT3904; Temperature: -55°C~150°C; ComponentLink1Description: DATASHEET; NameFromManufacturer: MMBT3904; ComponentLink1URL: https://www.terraelectronica.ru/product/607582; Datasheet: Datasheets/transistors/mmbt3904.pdf; Last changeв: 27.10.2022
X29 = XF2M30151A: FFC разъем, 30PIN, 0.5мм, 50В; Manufacturer: Omron; Check: False; Part Number: XF2M30151A; Value: XF2M30151A; NameFromManufacturer: XF2M30151A
X35 = PH2.0-01-15PZS: Pin Header 30 Position 2mm Pitch Dual Row Through Hole -40℃~+105℃; Manufacturer: XUNPU; Check: False; Part Number: PH2.0-01-15PZS; Value: PH2.0-01-15PZS; NameFromManufacturer: PH2.0-01-15PZS

## Sheet MIPI_x2CSI.SchDoc
size 420 x 297 mm; Scale: 1:1; DocumentType: Схема электрическая принципиальная; SheetNumber: 23; SheetTotal: 32; DocumentTypeShort: Э3; DocumentInvertoryNumber: ㅤ
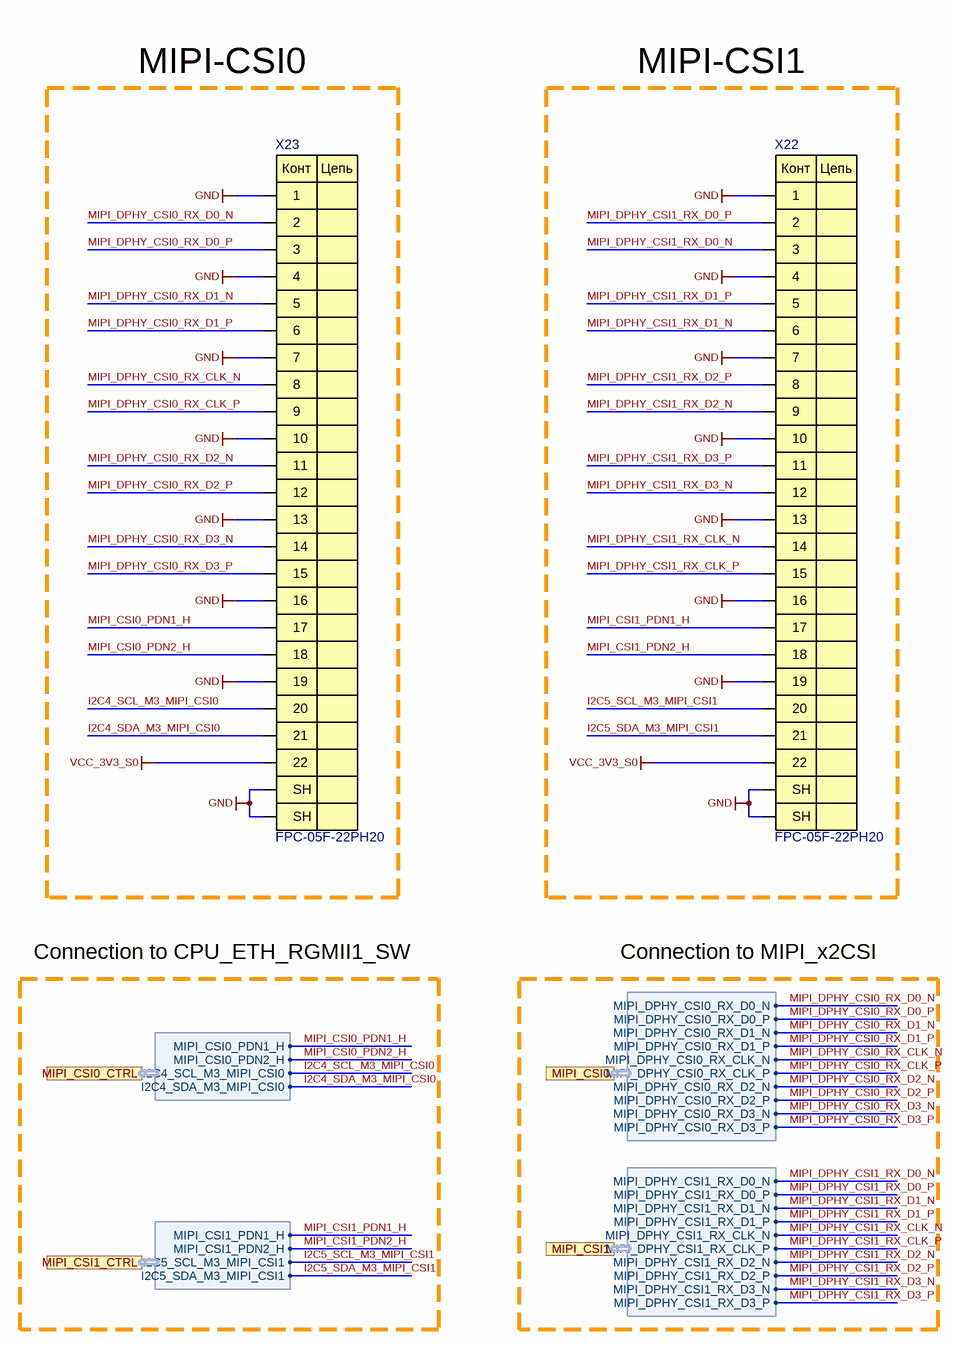
[diagram p19: MIPI_x2CSI.SchDoc]

### Parts
X22  FPC-05F-22PH20  [FPC-05F-22PH20]
X23  FPC-05F-22PH20  [FPC-05F-22PH20]

### Ports
MIPI_CSI0 (harness MIPI_CSI0), MIPI_CSI0_CTRL (harness MIPI_CSI0_CTRL), MIPI_CSI1 (harness MIPI_CSI1), MIPI_CSI1_CTRL (harness MIPI_CSI1_CTRL)

### Harnesses
MIPI_CSI0_CTRL: I2C4_SDA_M3_MIPI_CSI0, I2C4_SCL_M3_MIPI_CSI0, MIPI_CSI0_PDN2_H, MIPI_CSI0_PDN1_H
MIPI_CSI1_CTRL: I2C5_SDA_M3_MIPI_CSI1, I2C5_SCL_M3_MIPI_CSI1, MIPI_CSI1_PDN2_H, MIPI_CSI1_PDN1_H
MIPI_CSI1: MIPI_DPHY_CSI1_RX_D3_P, MIPI_DPHY_CSI1_RX_D3_N, MIPI_DPHY_CSI1_RX_D2_P, MIPI_DPHY_CSI1_RX_D2_N, MIPI_DPHY_CSI1_RX_CLK_P, MIPI_DPHY_CSI1_RX_CLK_N, MIPI_DPHY_CSI1_RX_D1_P, MIPI_DPHY_CSI1_RX_D1_N, MIPI_DPHY_CSI1_RX_D0_P, MIPI_DPHY_CSI1_RX_D0_N
MIPI_CSI0: MIPI_DPHY_CSI0_RX_D3_P, MIPI_DPHY_CSI0_RX_D3_N, MIPI_DPHY_CSI0_RX_D2_P, MIPI_DPHY_CSI0_RX_D2_N, MIPI_DPHY_CSI0_RX_CLK_P, MIPI_DPHY_CSI0_RX_CLK_N, MIPI_DPHY_CSI0_RX_D1_P, MIPI_DPHY_CSI0_RX_D1_N, MIPI_DPHY_CSI0_RX_D0_P, MIPI_DPHY_CSI0_RX_D0_N

### Nets
GND: X22.1 X22.4 X22.7 X22.10 X22.13 X22.16 X22.19 X22.23(SH) X22.24(SH) X23.1 X23.4 X23.7 X23.10 X23.13 X23.16 X23.19 X23.23(SH) X23.24(SH)
VCC_3V3_S0: X22.22 X23.22
I2C4_SCL_M3_MIPI_CSI0: X23.20 ; port MIPI_CSI0_CTRL.I2C4_SCL_M3_MIPI_CSI0
I2C4_SDA_M3_MIPI_CSI0: X23.21 ; port MIPI_CSI0_CTRL.I2C4_SDA_M3_MIPI_CSI0
I2C5_SCL_M3_MIPI_CSI1: X22.20 ; port MIPI_CSI1_CTRL.I2C5_SCL_M3_MIPI_CSI1
I2C5_SDA_M3_MIPI_CSI1: X22.21 ; port MIPI_CSI1_CTRL.I2C5_SDA_M3_MIPI_CSI1
MIPI_CSI0_PDN1_H: X23.17 ; port MIPI_CSI0_CTRL.MIPI_CSI0_PDN1_H  [project net MIPI_CSI0_CTRL.MIPI_CSI0_PDN1_H]
MIPI_CSI0_PDN2_H: X23.18 ; port MIPI_CSI0_CTRL.MIPI_CSI0_PDN2_H  [project net MIPI_CSI0_CTRL.MIPI_CSI0_PDN2_H]
MIPI_CSI1_PDN1_H: X22.17 ; port MIPI_CSI1_CTRL.MIPI_CSI1_PDN1_H  [project net MIPI_CSI1_CTRL.MIPI_CSI1_PDN1_H]
MIPI_CSI1_PDN2_H: X22.18 ; port MIPI_CSI1_CTRL.MIPI_CSI1_PDN2_H  [project net MIPI_CSI1_CTRL.MIPI_CSI1_PDN2_H]
MIPI_DPHY_CSI0_RX_CLK_N: X23.8 ; port MIPI_CSI0.MIPI_DPHY_CSI0_RX_CLK_N
MIPI_DPHY_CSI0_RX_CLK_P: X23.9 ; port MIPI_CSI0.MIPI_DPHY_CSI0_RX_CLK_P
MIPI_DPHY_CSI0_RX_D0_N: X23.2 ; port MIPI_CSI0.MIPI_DPHY_CSI0_RX_D0_N
MIPI_DPHY_CSI0_RX_D0_P: X23.3 ; port MIPI_CSI0.MIPI_DPHY_CSI0_RX_D0_P
MIPI_DPHY_CSI0_RX_D1_N: X23.5 ; port MIPI_CSI0.MIPI_DPHY_CSI0_RX_D1_N
MIPI_DPHY_CSI0_RX_D1_P: X23.6 ; port MIPI_CSI0.MIPI_DPHY_CSI0_RX_D1_P
MIPI_DPHY_CSI0_RX_D2_N: X23.11 ; port MIPI_CSI0.MIPI_DPHY_CSI0_RX_D2_N
MIPI_DPHY_CSI0_RX_D2_P: X23.12 ; port MIPI_CSI0.MIPI_DPHY_CSI0_RX_D2_P
MIPI_DPHY_CSI0_RX_D3_N: X23.14 ; port MIPI_CSI0.MIPI_DPHY_CSI0_RX_D3_N
MIPI_DPHY_CSI0_RX_D3_P: X23.15 ; port MIPI_CSI0.MIPI_DPHY_CSI0_RX_D3_P
MIPI_DPHY_CSI1_RX_CLK_N: X22.14 ; port MIPI_CSI1.MIPI_DPHY_CSI1_RX_CLK_N
MIPI_DPHY_CSI1_RX_CLK_P: X22.15 ; port MIPI_CSI1.MIPI_DPHY_CSI1_RX_CLK_P
MIPI_DPHY_CSI1_RX_D0_N: X22.3 ; port MIPI_CSI1.MIPI_DPHY_CSI1_RX_D0_N
MIPI_DPHY_CSI1_RX_D0_P: X22.2 ; port MIPI_CSI1.MIPI_DPHY_CSI1_RX_D0_P
MIPI_DPHY_CSI1_RX_D1_N: X22.6 ; port MIPI_CSI1.MIPI_DPHY_CSI1_RX_D1_N
MIPI_DPHY_CSI1_RX_D1_P: X22.5 ; port MIPI_CSI1.MIPI_DPHY_CSI1_RX_D1_P
MIPI_DPHY_CSI1_RX_D2_N: X22.9 ; port MIPI_CSI1.MIPI_DPHY_CSI1_RX_D2_N
MIPI_DPHY_CSI1_RX_D2_P: X22.8 ; port MIPI_CSI1.MIPI_DPHY_CSI1_RX_D2_P
MIPI_DPHY_CSI1_RX_D3_N: X22.12 ; port MIPI_CSI1.MIPI_DPHY_CSI1_RX_D3_N
MIPI_DPHY_CSI1_RX_D3_P: X22.11 ; port MIPI_CSI1.MIPI_DPHY_CSI1_RX_D3_P

### Notes on the sheet
- MIPI-CSI0
- MIPI-CSI1
- Connection to CPU_ETH_RGMII1_SW
- Connection to MIPI_x2CSI
- Подп. и дата
- Инв. № дубл.
- Взам. инв. №
- Инв. № подл.
- Изм.
- Лист
- № докум.
- Подп.
- Дата
- Копировал
- Формат А3
- (in symbol FPC-05F-22PH20) Конт; Цепь

### Library data of the parts
X22 X23 = FPC-05F-22PH20: FFC/FPC Connector 22 Position 0.5mm Pitch Bottom Contact Surface Mount, Right Angle -25℃~+85℃; Manufacturer: XUNPU; Check: False; Part Number: FPC-05F-22PH20; Value: FPC-05F-22PH20; NameFromManufacturer: FPC-05F-22PH20

## Sheet EXTENSIONS.SchDoc
size 420 x 297 mm; SheetNumber: 24; SheetTotal: 32; DocumentTypeShort: Э3; DocumentInvertoryNumber: ㅤ
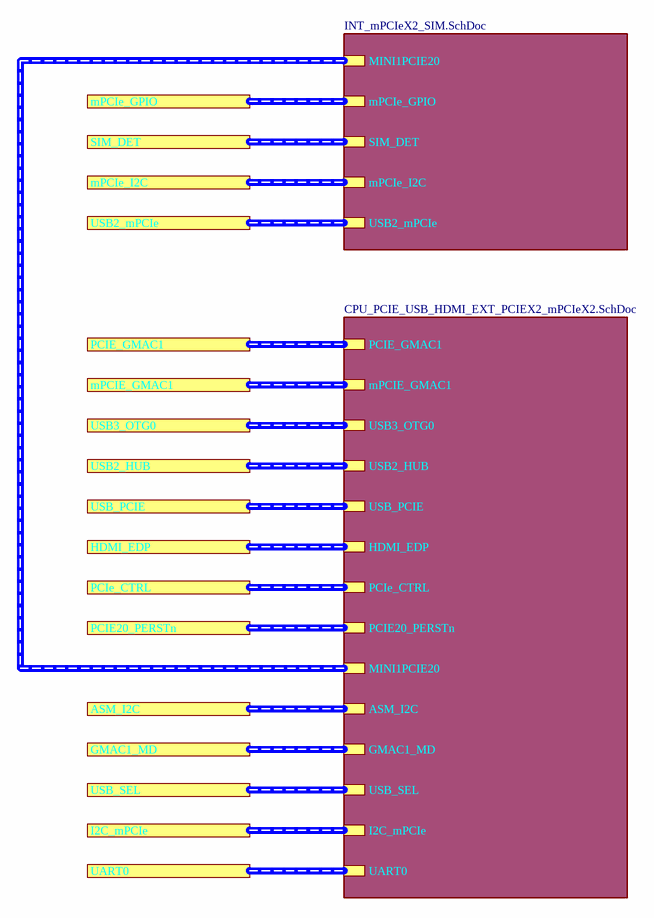
[diagram p20: EXTENSIONS.SchDoc]

### Sub-sheets
CPU_PCIE_USB_HDMI_EXT_PCIEX2_mPCIeX2 = CPU_PCIE_USB_HDMI_EXT_PCIEX2_mPCIeX2.SchDoc: PCIE_GMAC1 (harness PCIE_GMAC1), mPCIE_GMAC1 (harness mPCIE_GMAC1), USB3_OTG0 (harness USB3_OTG0), USB2_HUB (harness USB2_HUB), USB_PCIE (harness USB_PCIE), PCIe_CTRL (harness PCIe_CTRL), MINI1PCIE20 (harness MINI1PCIE20), HDMI_EDP (harness HDMI_EDP), ASM_I2C (harness ASM_I2C), GMAC1_MD (harness GMAC1_MD), PCIE20_PERSTn (harness PCIE20_PERSTn), USB_SEL (harness USB_SEL), I2C_mPCIe (harness I2C_mPCIe), UART0 (harness UART0)
INT_mPCIeX2_SIM = INT_mPCIeX2_SIM.SchDoc: mPCIe_GPIO (harness mPCIe_GPIO), SIM_DET (harness SIM_DET), mPCIe_I2C (harness mPCIe_I2C), USB2_mPCIe (harness USB2_mPCIe), MINI1PCIE20 (harness MINI1PCIE20)

### Ports
ASM_I2C, GMAC1_MD, HDMI_EDP, I2C_mPCIe, mPCIE_GMAC1, mPCIe_GPIO, mPCIe_I2C, PCIE20_PERSTn, PCIe_CTRL, PCIE_GMAC1, SIM_DET, UART0, USB2_HUB, USB2_mPCIe, USB3_OTG0, USB_PCIE, USB_SEL

### Buses and harness runs
harness port ASM_I2C = sheet CPU_PCIE_USB_HDMI_EXT_PCIEX2_mPCIeX2/ASM_I2C
harness port GMAC1_MD = sheet CPU_PCIE_USB_HDMI_EXT_PCIEX2_mPCIeX2/GMAC1_MD
harness port HDMI_EDP = sheet CPU_PCIE_USB_HDMI_EXT_PCIEX2_mPCIeX2/HDMI_EDP
harness port I2C_mPCIe = sheet CPU_PCIE_USB_HDMI_EXT_PCIEX2_mPCIeX2/I2C_mPCIe
harness port mPCIE_GMAC1 = sheet CPU_PCIE_USB_HDMI_EXT_PCIEX2_mPCIeX2/mPCIE_GMAC1
harness port mPCIe_GPIO = sheet INT_mPCIeX2_SIM/mPCIe_GPIO
harness port mPCIe_I2C = sheet INT_mPCIeX2_SIM/mPCIe_I2C
harness port PCIE20_PERSTn = sheet CPU_PCIE_USB_HDMI_EXT_PCIEX2_mPCIeX2/PCIE20_PERSTn
harness port PCIe_CTRL = sheet CPU_PCIE_USB_HDMI_EXT_PCIEX2_mPCIeX2/PCIe_CTRL
harness port PCIE_GMAC1 = sheet CPU_PCIE_USB_HDMI_EXT_PCIEX2_mPCIeX2/PCIE_GMAC1
harness port SIM_DET = sheet INT_mPCIeX2_SIM/SIM_DET
harness port UART0 = sheet CPU_PCIE_USB_HDMI_EXT_PCIEX2_mPCIeX2/UART0
harness port USB2_HUB = sheet CPU_PCIE_USB_HDMI_EXT_PCIEX2_mPCIeX2/USB2_HUB
harness port USB2_mPCIe = sheet INT_mPCIeX2_SIM/USB2_mPCIe
harness port USB3_OTG0 = sheet CPU_PCIE_USB_HDMI_EXT_PCIEX2_mPCIeX2/USB3_OTG0
harness port USB_PCIE = sheet CPU_PCIE_USB_HDMI_EXT_PCIEX2_mPCIeX2/USB_PCIE
harness port USB_SEL = sheet CPU_PCIE_USB_HDMI_EXT_PCIEX2_mPCIeX2/USB_SEL
harness sheet CPU_PCIE_USB_HDMI_EXT_PCIEX2_mPCIeX2/MINI1PCIE20 = sheet INT_mPCIeX2_SIM/MINI1PCIE20

### Notes on the sheet
- Подп. и дата
- Инв. № дубл.
- Взам. инв. №
- Инв. № подл.
- Изм.
- Лист
- № докум.
- Подп.
- Дата
- Копировал
- Формат А3

## Sheet INT_mPCIeX2_SIM.SchDoc
size 420 x 297 mm; Scale: 1:1; DocumentType: Схема электрическая принципиальная; SheetNumber: 25; SheetTotal: 32; DocumentTypeShort: Э3; DocumentInvertoryNumber: ㅤ
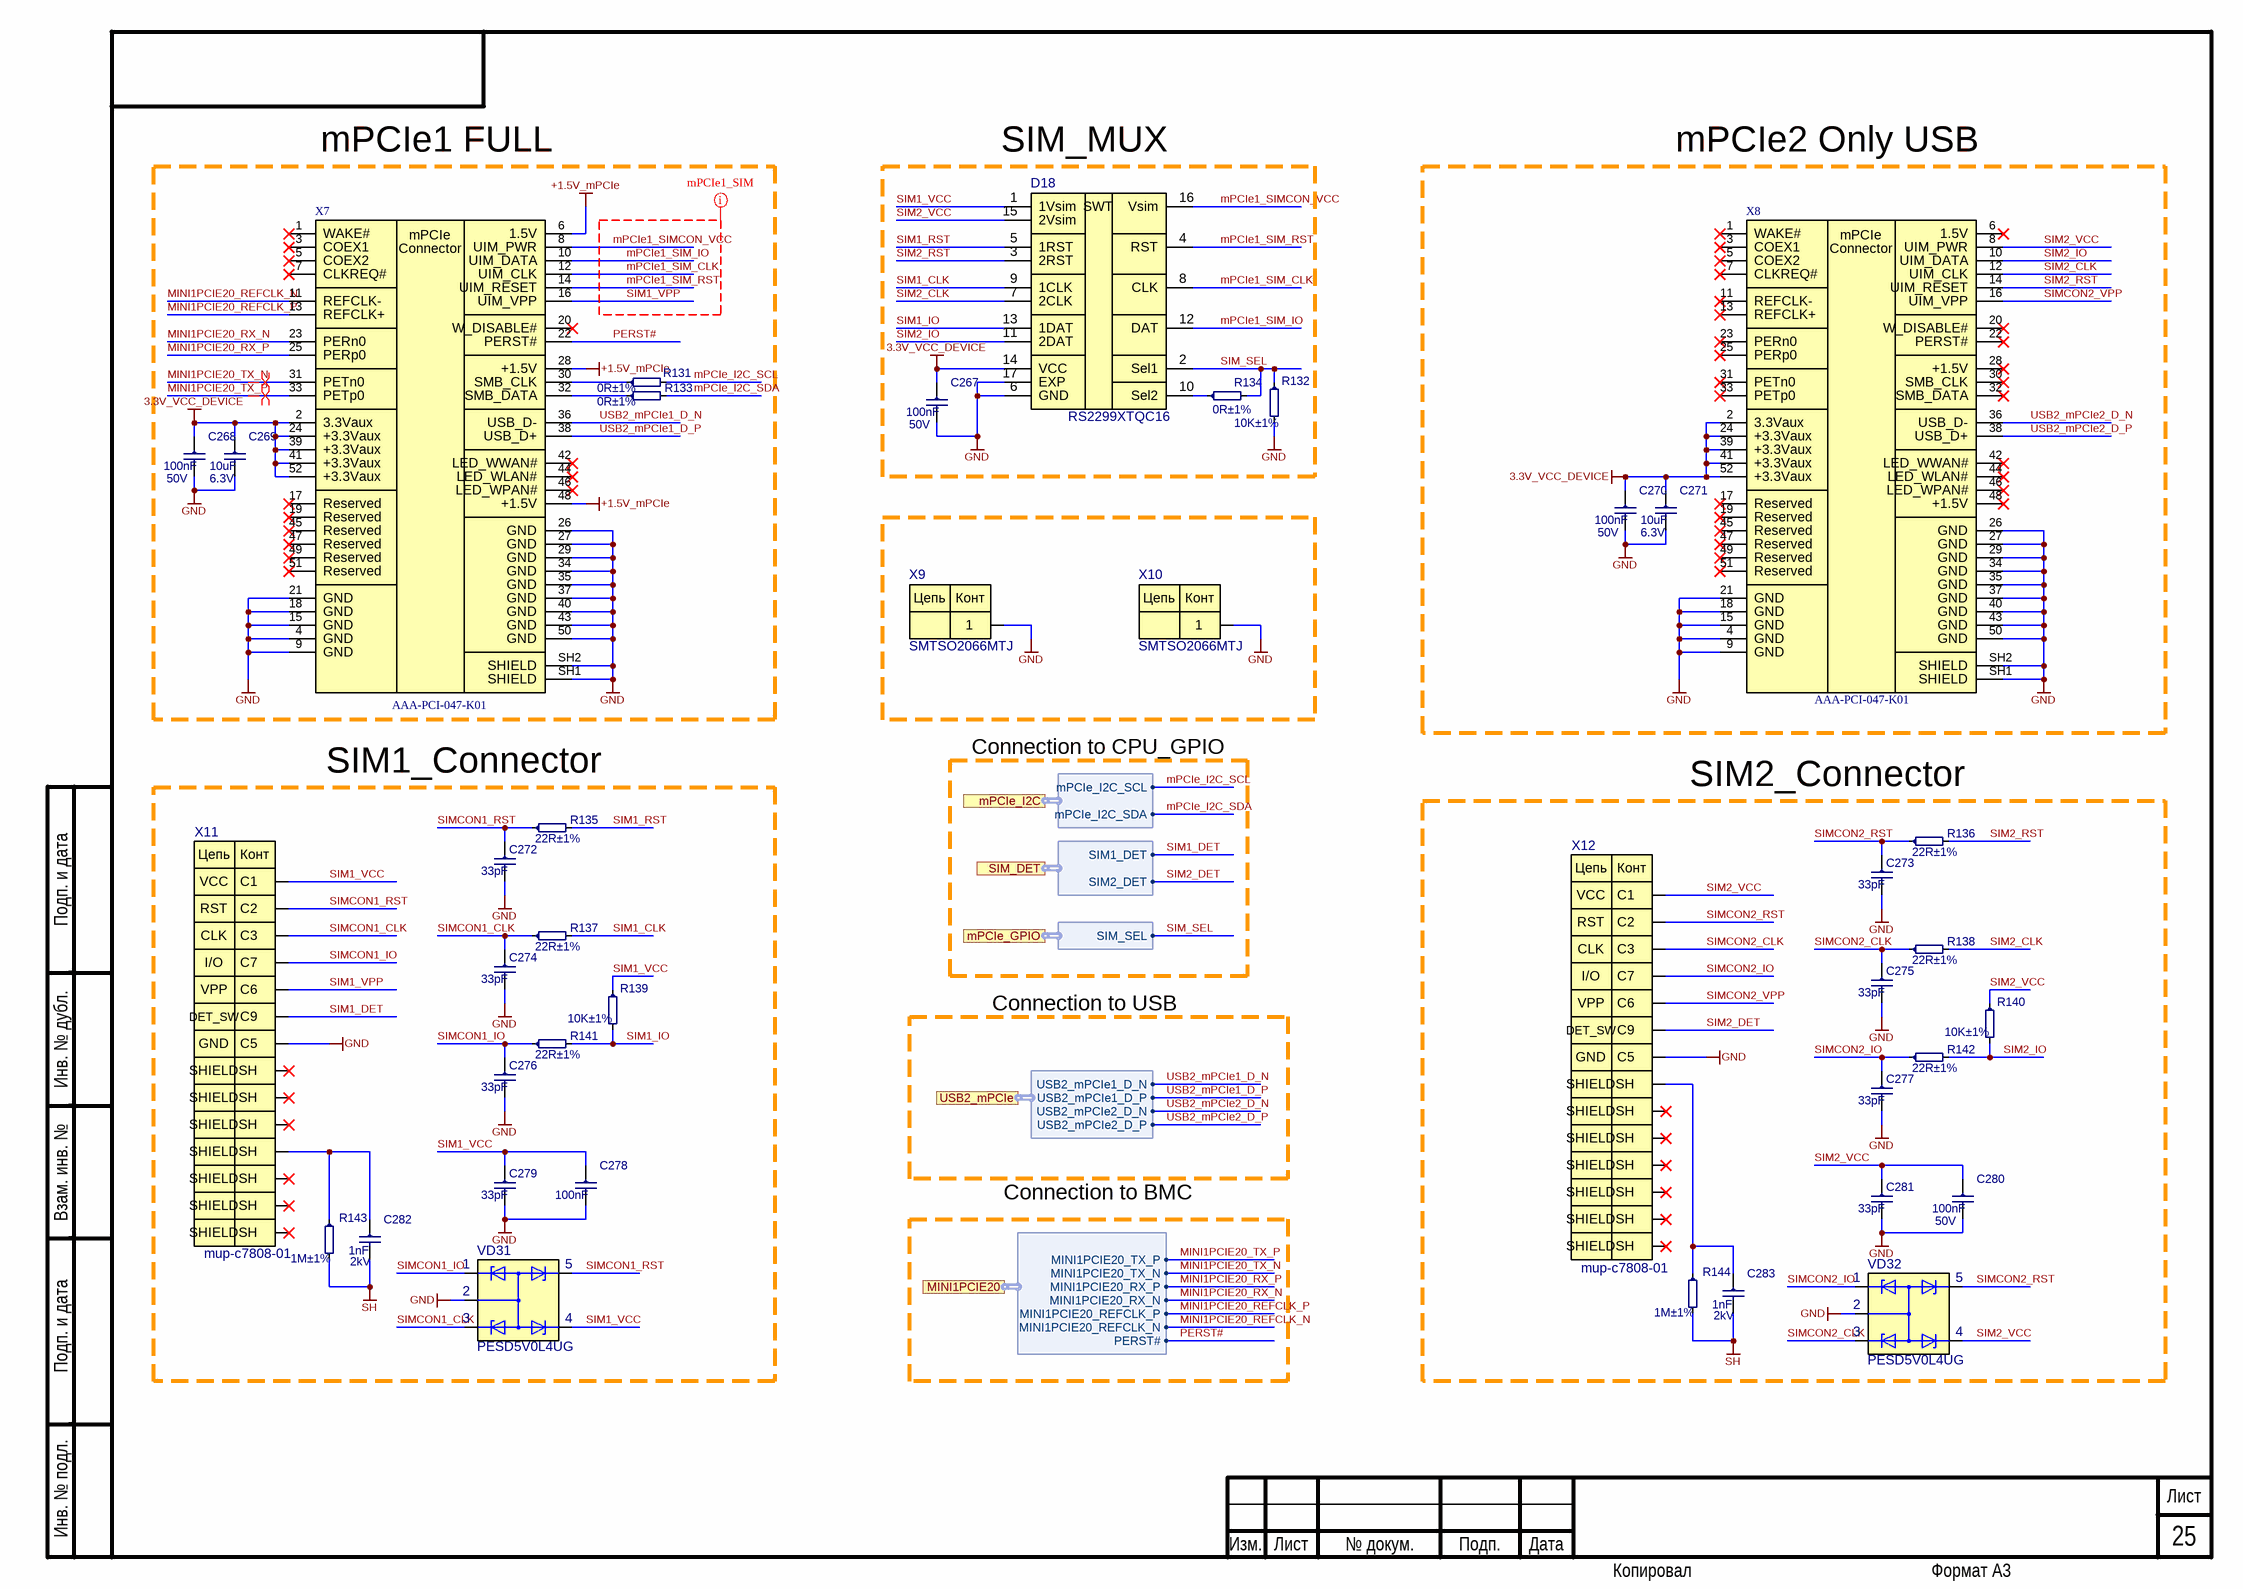
[diagram p21: INT_mPCIeX2_SIM.SchDoc]

### Parts
C267  100nF  Voltage: 50V  [C0402]
C268  100nF  Voltage: 50V  [C0402]
C269  10uF  Voltage: 6.3V  [C0402]
C270  100nF  Voltage: 50V  [C0402]
C271  10uF  Voltage: 6.3V  [C0402]
C272  33pF  [C0402]
C273  33pF  [C0402]
C274  33pF  [C0402]
C275  33pF  [C0402]
C276  33pF  [C0402]
C277  33pF  [C0402]
C278  100nF  [C0402]
C279  33pF  [C0402]
C280  100nF  Voltage: 50V  [C0402]
C281  33pF  [C0402]
C282  1nF  Voltage: 2kV  [C1812]
C283  1nF  Voltage: 2kV  [C1812]
D18  RS2299XTQC16  [RS2299XTQC16]
R131  0R±1%  [R0402]
R132  10K±1%  [R0402]
R133  0R±1%  [R0402]
R134  0R±1%  [R0402]
R135  22R±1%  [R0402]
R136  22R±1%  [R0402]
R137  22R±1%  [R0402]
R138  22R±1%  [R0402]
R139  10K±1%  [R0402]
R140  10K±1%  [R0402]
R141  22R±1%  [R0402]
R142  22R±1%  [R0402]
R143  1M±1%  [R1206]
R144  1M±1%  [R1206]
VD31  PESD5V0L4UG  [TSSOP5-5]
VD32  PESD5V0L4UG  [TSSOP5-5]
X7  AAA-PCI-047-K01  [AAA-PCI-047-K01]
X8  AAA-PCI-047-K01  [AAA-PCI-047-K01]
X9  SMTSO2066MTJ  [SMTSO2066MTJ]
X10  SMTSO2066MTJ  [SMTSO2066MTJ]
X11  mup-c7808-01  [mup-c7808]
X12  mup-c7808-01  [mup-c7808]

### Ports
MINI1PCIE20 (harness MINI1PCIE20), mPCIe_GPIO (harness mPCIe_GPIO), mPCIe_I2C (harness mPCIe_I2C), SIM_DET (harness SIM_DET), USB2_mPCIe (harness USB2_mPCIe)

### Harnesses
mPCIe_GPIO: SIM_SEL
SIM_DET: SIM1_DET, SIM2_DET
mPCIe_I2C: mPCIe_I2C_SDA, mPCIe_I2C_SCL
USB2_mPCIe: USB2_mPCIe1_D_P, USB2_mPCIe1_D_N, USB2_mPCIe2_D_P, USB2_mPCIe2_D_N
MINI1PCIE20: MINI1PCIE20_TX_N, MINI1PCIE20_RX_P, MINI1PCIE20_RX_N, MINI1PCIE20_TX_P, MINI1PCIE20_REFCLK_P, MINI1PCIE20_REFCLK_N, PERST#

### Nets
3.3V_VCC_DEVICE: C267.1 C268.1 C269.1 C270.1 C271.1 D18.14(VCC) X7.2(3.3Vaux) X7.24(+3.3Vaux) X7.39(+3.3Vaux) X7.41(+3.3Vaux) X7.52(+3.3Vaux) X8.2(3.3Vaux) X8.24(+3.3Vaux) X8.39(+3.3Vaux) X8.41(+3.3Vaux) X8.52(+3.3Vaux)
+1.5V_mPCIe: X7.6(1.5V) X7.28(+1.5V) X7.48(+1.5V)
GND: C267.2 C268.2 C269.2 C270.2 C271.2 C272.2 C273.2 C274.2 C275.2 C276.2 C277.2 C278.2 C279.2 C280.2 C281.2 D18.6(GND) D18.17(EXP) R132.2 VD31.2 VD32.2 X7.4(GND) X7.9(GND) X7.15(GND) X7.18(GND) X7.21(GND) X7.26(GND) X7.27(GND) X7.29(GND) X7.34(GND) X7.35(GND) X7.37(GND) X7.40(GND) X7.43(GND) X7.50(GND) X7.SH1(SHIELD) X7.SH2(SHIELD) X8.4(GND) X8.9(GND) X8.15(GND) X8.18(GND) X8.21(GND) X8.26(GND) X8.27(GND) X8.29(GND) X8.34(GND) X8.35(GND) X8.37(GND) X8.40(GND) X8.43(GND) X8.50(GND) X8.SH1(SHIELD) X8.SH2(SHIELD) X9.1 X10.1 X11.C5 X12.C5
SH: C282.2 C283.2 R143.2 R144.2
MINI1PCIE20_REFCLK_N: X7.11(REFCLK-) ; port MINI1PCIE20.MINI1PCIE20_REFCLK_N
MINI1PCIE20_REFCLK_P: X7.13(REFCLK+) ; port MINI1PCIE20.MINI1PCIE20_REFCLK_P
MINI1PCIE20_RX_N: X7.23(PERn0) ; port MINI1PCIE20.MINI1PCIE20_RX_N
MINI1PCIE20_RX_P: X7.25(PERp0) ; port MINI1PCIE20.MINI1PCIE20_RX_P
MINI1PCIE20_TX_N: X7.31(PETn0) ; port MINI1PCIE20.MINI1PCIE20_TX_N
MINI1PCIE20_TX_P: X7.33(РЕТр0) ; port MINI1PCIE20.MINI1PCIE20_TX_P
mPCIe1_SIM_CLK: D18.8(CLK) X7.12(UIM_CLK)
mPCIe1_SIM_IO: D18.12(DAT) X7.10(UIM_DATA)
mPCIe1_SIM_RST: D18.4(RST) X7.14(UIM_RESET)
mPCIe1_SIMCON_VCC: D18.16(Vsim) X7.8(UIM_PWR)
mPCIe_I2C_SCL: R131.2 ; port mPCIe_I2C.mPCIe_I2C_SCL  [project net mPCIe_I2C.mPCIe_I2C_SCL]
mPCIe_I2C_SDA: R133.2 ; port mPCIe_I2C.mPCIe_I2C_SDA  [project net mPCIe_I2C.mPCIe_I2C_SDA]
PERST#: X7.22(PERST#) ; port MINI1PCIE20.PERST#
SIM1_CLK: D18.9(1CLK) R137.2
SIM1_DET: X11.C9 ; port SIM_DET.SIM1_DET
SIM1_IO: D18.13(1DAT) R139.2 R141.2
SIM1_RST: D18.5(1RST) R135.2
SIM1_VCC: C278.1 C279.1 D18.1(1Vsim) R139.1 VD31.4 X11.C1
SIM1_VPP: X7.16(UIM_VPP) X11.C6
SIM2_CLK: D18.7(2CLK) R138.2 X8.12(UIM_CLK)
SIM2_DET: X12.C9 ; port SIM_DET.SIM2_DET
SIM2_IO: D18.11(2DAT) R140.2 R142.2 X8.10(UIM_DATA)
SIM2_RST: D18.3(2RST) R136.2 X8.14(UIM_RESET)
SIM2_VCC: C280.1 C281.1 D18.15(2Vsim) R140.1 VD32.4 X8.8(UIM_PWR) X12.C1
SIM_SEL: D18.2(Sel1) R132.1 R134.2 ; port mPCIe_GPIO.SIM_SEL  [project net mPCIe_GPIO.SIM_SEL]
SIMCON1_CLK: C274.1 R137.1 VD31.3 X11.C3
SIMCON1_IO: C276.1 R141.1 VD31.1 X11.C7
SIMCON1_RST: C272.1 R135.1 VD31.5 X11.C2
SIMCON2_CLK: C275.1 R138.1 VD32.3 X12.C3
SIMCON2_IO: C277.1 R142.1 VD32.1 X12.C7
SIMCON2_RST: C273.1 R136.1 VD32.5 X12.C2
SIMCON2_VPP: X8.16(UIM_VPP) X12.C6
USB2_mPCIe1_D_N: X7.36(USB_D-) ; port USB2_mPCIe.USB2_mPCIe1_D_N  [project net USB2_mPCIe.USB2_mPCIe1_D_N]
USB2_mPCIe1_D_P: X7.38(USB_D+) ; port USB2_mPCIe.USB2_mPCIe1_D_P  [project net USB2_mPCIe.USB2_mPCIe1_D_P]
USB2_mPCIe2_D_N: X8.36(USB_D-) ; port USB2_mPCIe.USB2_mPCIe2_D_N  [project net USB2_mPCIe.USB2_mPCIe2_D_N]
USB2_mPCIe2_D_P: X8.38(USB_D+) ; port USB2_mPCIe.USB2_mPCIe2_D_P  [project net USB2_mPCIe.USB2_mPCIe2_D_P]
NetC282_1: C282.1 R143.1 X11.SH4(SH)
NetC283_1: C283.1 R144.1 X12.SH1(SH)
NetD18_10: D18.10(Sel2) R134.1
NetR131_1: R131.1 X7.30(SMB_CLK)
NetR133_1: R133.1 X7.32(SMB_DATA)

Not connected (* = marked no-connect by the designer): X7 1(WAKE#)* 3(СОЕХ1)* 5(СОЕХ2)* 7(CLKREQ#)* 17(Reserved)* 19(Reserved)* 20(W_DISABLE#)* 42(LED_WWAN#)* 44(LED_WLAN#)* 45(Reserved)* 46(LED_WPAN#)* 47(Reserved)* 49(Reserved)* 51(Reserved)*; X8 1(WAKE#)* 3(СОЕХ1)* 5(СОЕХ2)* 6(1.5V)* 7(CLKREQ#)* 11(REFCLK-)* 13(REFCLK+)* 17(Reserved)* 19(Reserved)* 20(W_DISABLE#)* 22(PERST#)* 23(PERn0)* 25(PERp0)* 28(+1.5V)* 30(SMB_CLK)* 31(PETn0)* 32(SMB_DATA)* 33(РЕТр0)* 42(LED_WWAN#)* 44(LED_WLAN#)* 45(Reserved)* 46(LED_WPAN#)* 47(Reserved)* 48(+1.5V)* 49(Reserved)* 51(Reserved)*; X11 SH1(SH)* SH2(SH)* SH3(SH)* SH5(SH)* SH6(SH)* SH7(SH)*; X12 SH2(SH)* SH3(SH)* SH4(SH)* SH5(SH)* SH6(SH)* SH7(SH)*

### Layout directives
net class mPCIe1_SIM: mPCIe1_SIM_CLK, mPCIe1_SIM_IO, mPCIe1_SIM_RST, mPCIe1_SIMCON_VCC, SIM1_VPP
differential pair; differential pair class Diff_Z85: MINI1PCIE20_TX_N, MINI1PCIE20_TX_P

### Notes on the sheet
- mPCIe1 FULL
- (near D18) SIM_MUX
- mPCIe2 Only USB
- SIM1_Connector
- Connection to CPU_GPIO
- SIM2_Connector
- Connection to USB
- Connection to BMC
- Подп. и дата
- Инв. № дубл.
- Взам. инв. №
- Инв. № подл.
- Изм.
- Лист
- № докум.
- Подп.
- Дата
- Копировал
- Формат А3
- (in symbol AAA-PCI-047-K01) mPCIe; Connector
- (in symbol mup-c7808) Цепь; Конт; VCC; RST; CLK; I/O; VPP; DET_SW; GND; SHIELD
- (in symbol RS2299XTQC16) SWT
- (in symbol SMTSO2066MTJ) Цепь; Конт

### Library data of the parts
C267 C268 C270 C278 C280 = 0402-X7R-50V-0.1uF±10%: as C560-C562 on sheet V-by-One; Dielectric: X7R; Case: C0402; Part Number: 0402-X7R-50V-0.1uF±10%; Value: 100nF; Tolerance: 10%; Temperature: -55°C~125°C; ComponentLink2Description: Link to datasheet; ComponentLink1Description: DATASHEET; ComponentLink2URL: https://www.lcsc.com/product-detail/Multilayer-Ceramic-Capacitors-MLCC-SMD-SMT_YAGEO-CC0402KRX7R9BB104_C131394.html; Last changed: 09.04.2025
  C278: Voltage: 50V
C269 C271 = 0402-X5R-6.3V-10uF±20%: Manufacturer: Yageo; NameFromManufacturer: CC0402MRX5R5BB106; Dielectric: X5R; Place: *); Tolerance: 20%; Check: False; Case: C0402; Part Number: 0402-X5R-6.3V-10uF±20%; Value: 10uF; Temperature: -55°C~125°C; ComponentLink2Description: Link to datasheet; ComponentLink1Description: DATASHEET; ComponentLink2URL: https://ru.mouser.com/ProductDetail/YAGEO/CC0402MRX5R5BB106?qs=%2Fha2pyFadujQAk9rG2cgJj8l7IbODD3KVaDjvxAcKzu9LtlLnRlq6Q%3D%3D; ComponentLink1URL: Datasheets/capacitors/UPY-GPHC_X5R_4V-to-50V_27.pdf; Last changed: 27.10.2022
C272-C277 C279 C281 = 0402-NP0-50V-33pF±5%: Manufacturer: Yageo; NameFromManufacturer: CC0402FRNPO9BN330; Dielectric: NP0; Voltage: 50V; Place: *); Tolerance: 5%; Check: False; Case: C0402; Part Number: 0402-NP0-50V-33pF±5%; Value: 33pF; Temperature: -55°C~125°C; ComponentLink2Description: Link to datasheet; ComponentLink1Description: DATASHEET; ComponentLink2URL: https://www.terraelectronica.ru/pdf/show?pdf_file=http%253A%252F%252Fwww.farnell.com%252Fdatasheets%252F2710587.pdf; ComponentLink1URL: Datasheets/capacitors/DOC012633270.pdf; Last changed: 27.10.2022
C282 C283 = 1812-C0G-2kV-1uF±10%: *; Part Number: 1812-C0G-2kV-1nF±10%; Manufacturer: FH; NameFromManufacturer: 1812B102K202NT; Dielectric: C0G; Place: *); Tolerance: 5%; Check: False; Case: CASE; Value: 1nF; Temperature: -55°C~125°C; ComponentLink2Description: Link to datasheet; ComponentLink1Description: DATASHEET; ComponentLink2URL: https://octopart.com/1812ga102jat2a-avx-75165070?r=sp; ComponentLink1URL: Datasheets/capacitors/C0GNP0-Dielectric.pdf; Last changed: 27.10.2022
D18 = RS2299XTQC16: Analog Switches; Manufacturer: RUNIC Tech; Check: False; Part Number: RS2299XTQC16; Value: RS2299XTQC16; NameFromManufacturer: RS2299XTQC16
R131 R133 R134 = 0402-0.0625W-0R-100ppm±1%: as R239 on sheet V-by-One; Case: R0402; Part Number: 0402-0.0625W-0R-100ppm±1%; Tolerance: 1%; Temperature: -55°C~155°C; ComponentLink1Description: DATASHEET; ComponentLink1URL: https://www.chipdip.ru/product0/8000617426?ysclid=l7og5x0plo427794326; Datasheet: Datasheets/resistors/DOC012445956.pdf; Last changed: 27.10.2022
R132 R139 R140 = 0402-0.0625W-10K-100ppm±1%: as R444 on sheet V-by-One; Case: R0402; Part Number: 0402-0.0625W-10K-100ppm±1%; Tolerance: 1%; Temperature: -55°C~155°C; ComponentLink1Description: DATASHEET; ComponentLink1URL: https://ru.mouser.com/ProductDetail/YAGEO/RC0402FR-0710KL?qs=%2Fha2pyFaduhjtLcYvKXQ8IogF7YwN7YtH%252BOO8ZtEEMnoa4yoWYcwpw%3D%3D; Datasheet: Datasheets/resistors/PYu-RC_Group_51_RoHS_L_11.pdf; Last changed: 27.10.2022
R135-R138 R141 R142 = 0402-0.0625W-22R-100ppm±1%: as R459 on sheet V-by-One; Case: R0402; Part Number: 0402-0.0625W-22R-100ppm±1%; Tolerance: 1%; Temperature: -55°C~155°C; ComponentLink1Description: DATASHEET; ComponentLink1URL: https://www.yageo.com/upload/media/product/productsearch/datasheet/rchip/PYu-RC_Group_51_RoHS_L_11.pdf; Datasheet: Datasheets/resistors/PYu-RC_Group_51_RoHS_L_11.pdf; Last changed: 27.10.2022
R143 R144 = 1206-0.25W-1M-100ppm±1%: Chip Resistor 1206 1MΩ ±1% 200V ±100ppm/℃ Thick Film; NameFromManufacturer: RC1206FR-071ML; Manufacturer: Yageo; Place: *); Value: 1M; Check: False; Case: R1206; Part Number: 1206-0.25W-1M-100ppm±1%; Tolerance: 1%; Temperature: -55°C~155°C; ComponentLink1Description: DATASHEET; ComponentLink1URL: https://www.lcsc.com/product-detail/Chip-Resistor-Surface-Mount_YAGEO-RC1206FR-071ML_C108083.html?s_z=n_RC1206FR-071ML; Last changed: 09.04.2025
VD31 VD32 = PESD5V0L4UG,115: Low capacitance unidirectional quadruple ESD protectiondiode arrays; Manufacturer: Tech Public Co.; Place: S; Check: False; Part Number: PESD5V0L4UG; Value: PESD5V0L4UG; Temperature: -65°C~150°C; ComponentLink1Description: DATASHEET; NameFromManufacturer: PESD5V0L4UG; ComponentLink1URL: https://ru.mouser.com/datasheet/2/916/PESDXL4UF_G_W-1599806.pdf; Last changed: 09.08.2021
  VD32: Datasheet: #https://ru.mouser.com/datasheet/2/916/PESDXL4UF_G_W-1599806.pdf#
X7 X8 = AAA-PCI-047-K01: mPCI-E Surface Mount 52 SMD,P=0.8mm Card Edge Connectors; Manufacturer: LOTES; Place: S; Check: False; Value: AAA-PCI-047-K01; Part Number: AAA-PCI-047-K01; NameFromManufacturer: AAA-PCI-047-K01; ComponentLink1Description: DATASHEET; Last changed: 24.03.2023
X9 X10 = SMTSO2066MTJ: Manufacturer: Sinhoo; Check: False; Part Number: SMTSO2066MTJ; Value: SMTSO2066MTJ; NameFromManufacturer: SMTSO2066MTJ
X11 X12 = mup-c7808: Manufacturer: MUP; Check: False; Part Number: mup-c7808-01; Value: mup-c7808-01; NameFromManufacturer: mup-c7808-01